# EAGLE design usb_fpga (EAGLE 5.10)
DIGIKEY: CTX283LVCT-ND

## Sheet 1 of 2
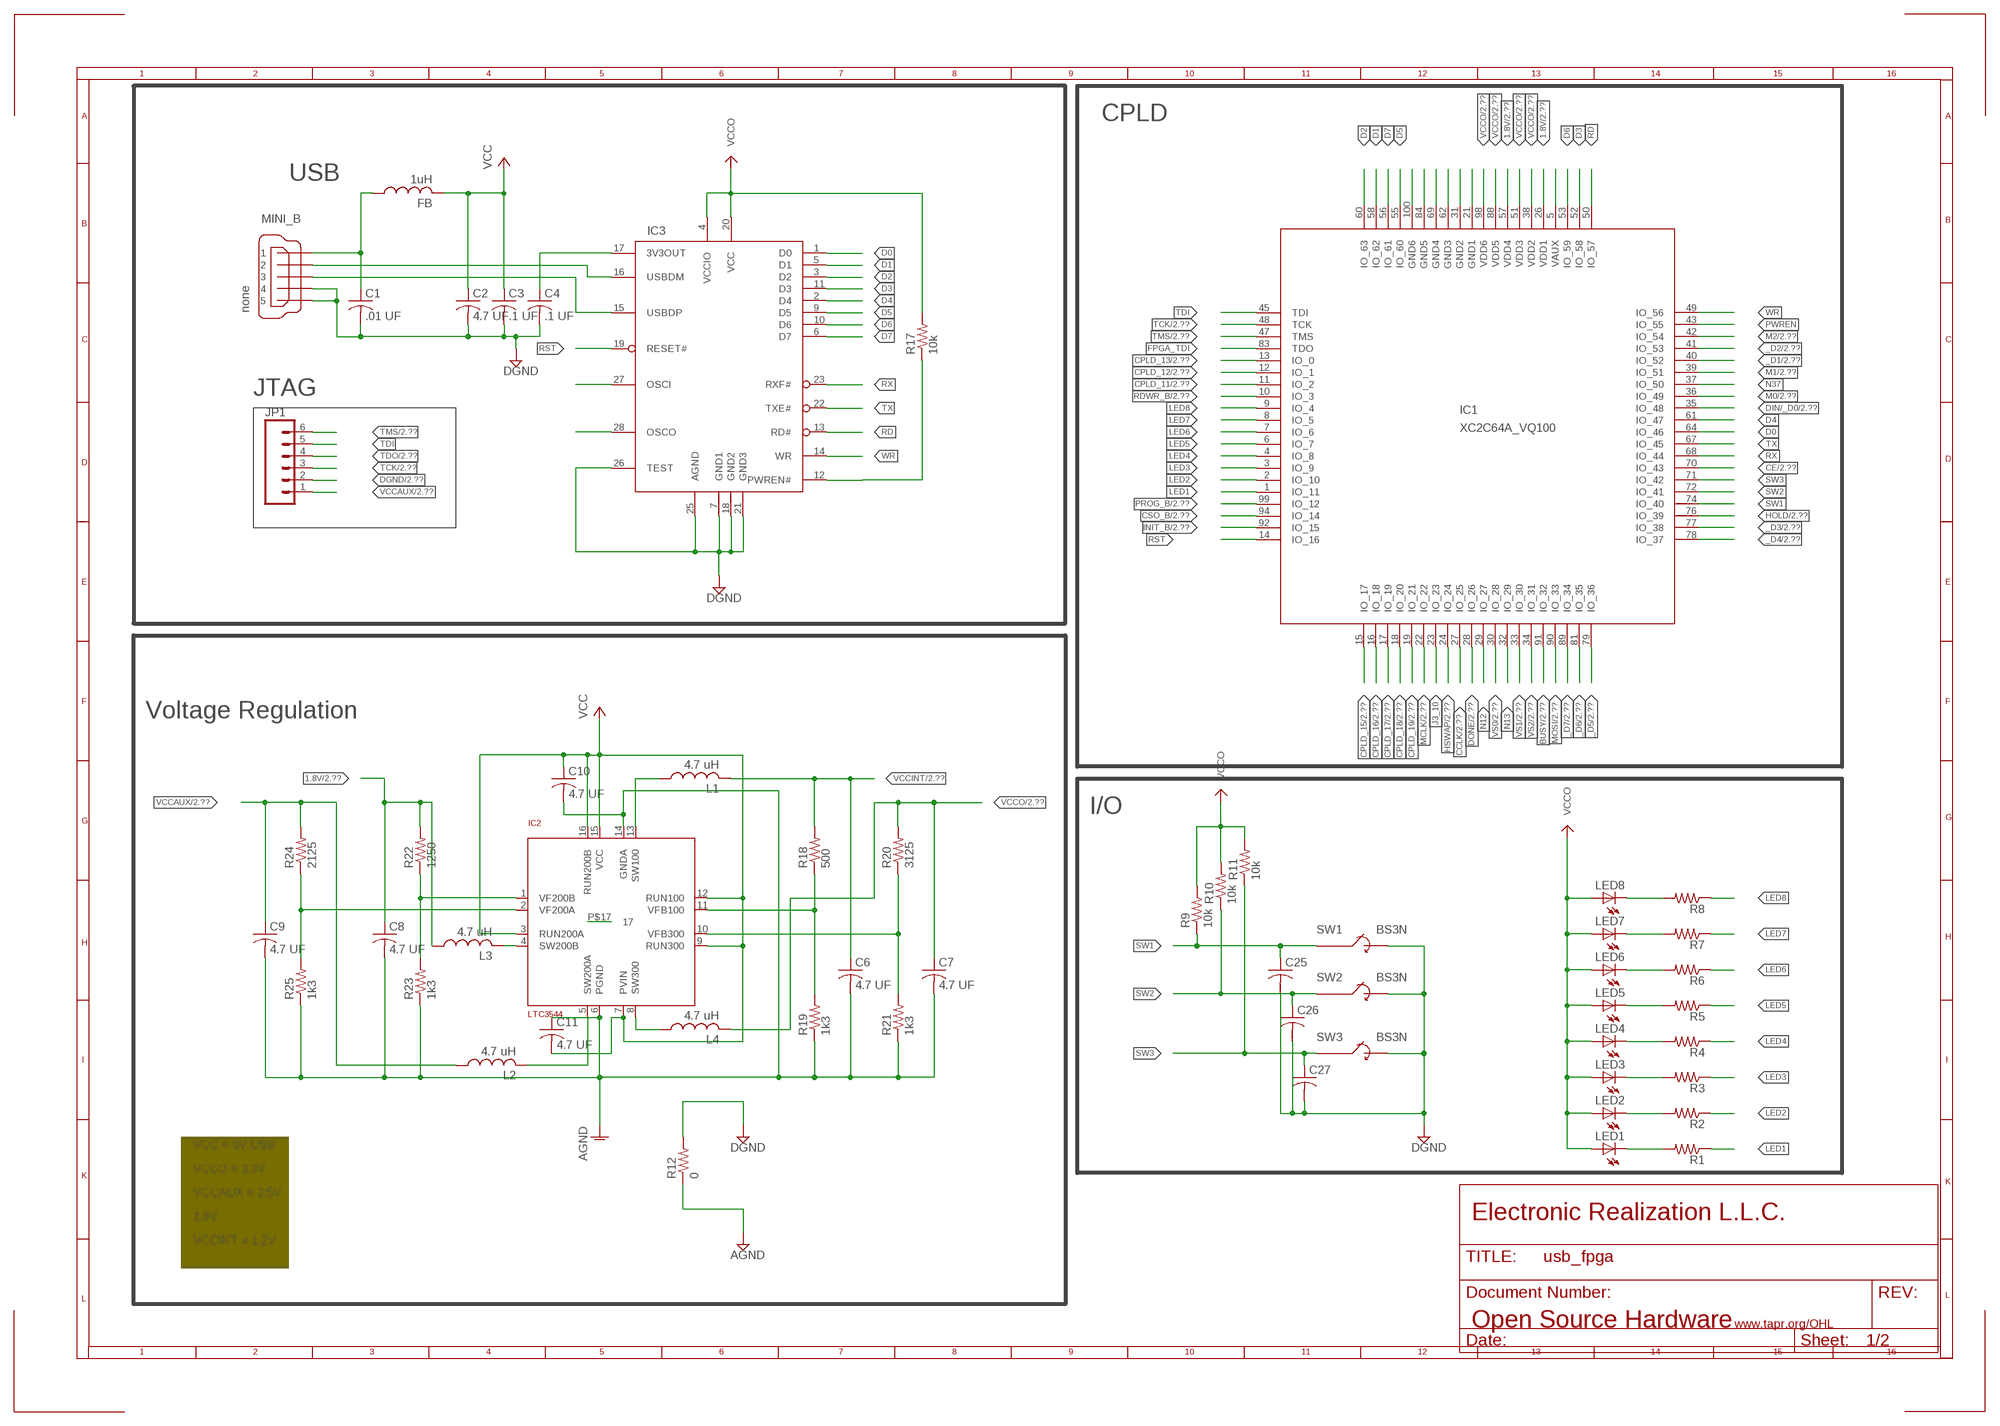
[diagram p0: schematic, sheet 1]

### Parts
C1  .01 UF  C-USC0402  [C0402]
C2  4.7 UF  C-USC0402  [C0402]
C3  .1 UF  C-USC0402  [C0402]
C4  .1 UF  C-USC0402  [C0402]
C6  4.7 UF  C-USC0402  [C0402]
C7  4.7 UF  C-USC0402  [C0402]
C8  4.7 UF  C-USC0402  [C0402]
C9  4.7 UF  C-USC0402  [C0402]
C10  4.7 UF  C-USC0402  [C0402]
C11  4.7 UF  C-USC0402  [C0402]
C25  C-USC0402  [C0402]
C26  C-USC0402  [C0402]
C27  C-USC0402  [C0402]
FB  1uH  FB  [R0805]
IC1  XC2C64A_VQ100  [VQ100]
IC2  LTC3544  [QFN16]
IC3  FT245RL  [SSOP28DB]
JP1  M06POLAR_LOCK  [MOLEX-1X6_LOCK]
L1  4.7 uH  TDK3010  [L3010]
L2  4.7 uH  TDK3010  [L3010]
L3  4.7 uH  TDK3010  [L3010]
L4  4.7 uH  TDK3010  [L3010]
LED1  LEDCHIPLED_0603  [CHIPLED_0603]
LED2  LEDCHIPLED_0603  [CHIPLED_0603]
LED3  LEDCHIPLED_0603  [CHIPLED_0603]
LED4  LEDCHIPLED_0603  [CHIPLED_0603]
LED5  LEDCHIPLED_0603  [CHIPLED_0603]
LED6  LEDCHIPLED_0603  [CHIPLED_0603]
LED7  LEDCHIPLED_0603  [CHIPLED_0603]
LED8  LEDCHIPLED_0603  [CHIPLED_0603]
MINI_B  none  MINI-USB-UX60A-MB-5ST  [UX60A-MB-5ST]
R1  R-US_R0402  [R0402]
R2  R-US_R0402  [R0402]
R3  R-US_R0402  [R0402]
R4  R-US_R0402  [R0402]
R5  R-US_R0402  [R0402]
R6  R-US_R0402  [R0402]
R7  R-US_R0402  [R0402]
R8  R-US_R0402  [R0402]
R9  10k  R-US_R0402  [R0402]
R10  10k  R-US_R0402  [R0402]
R11  10k  R-US_R0402  [R0402]
R12  0  R-US_R0402  [R0402]
R17  10k  R-US_R0402  [R0402]
R18  500  R-US_R0402  [R0402]
R19  1k3  R-US_R0402  [R0402]
R20  3125  R-US_R0402  [R0402]
R21  1k3  R-US_R0402  [R0402]
R22  1250  R-US_R0402  [R0402]
R23  1k3  R-US_R0402  [R0402]
R24  2125  R-US_R0402  [R0402]
R25  1k3  R-US_R0402  [R0402]
SW1  BS3N  [BS3N]
SW2  BS3N  [BS3N]
SW3  BS3N  [BS3N]

### Nets
1.8V: C8.1 IC1.26(VDD1) IC1.57(VDD4) L3.P$1 R22.2 ; also sheet 2
_D1: IC1.40(IO_52) ; also sheet 2
_D2: IC1.41(IO_53) ; also sheet 2
_D3: IC1.77(IO_38) ; also sheet 2
_D4: IC1.78(IO_37) ; also sheet 2
_D5: IC1.79(IO_36) ; also sheet 2
_D6: IC1.81(IO_35) ; also sheet 2
_D7: IC1.89(IO_34) ; also sheet 2
AGND: C6.2 C7.2 C8.2 C9.2 C10.2 C11.1 IC2.6(PGND) IC2.14(GNDA) IC2.P$17 R12.1 R19.1 R21.1 R23.1 R25.1
BUSY: IC1.91(IO_32) ; also sheet 2
CCLK: IC1.27(IO_25) ; also sheet 2
CE: IC1.70(IO_43) ; also sheet 2
CPLD_11: IC1.11(IO_2) ; also sheet 2
CPLD_12: IC1.12(IO_1) ; also sheet 2
CPLD_13: IC1.13(IO_0) ; also sheet 2
CPLD_15: IC1.15(IO_17) ; also sheet 2
CPLD_16: IC1.16(IO_18) ; also sheet 2
CPLD_17: IC1.17(IO_19) ; also sheet 2
CPLD_18: IC1.18(IO_20) ; also sheet 2
CPLD_19: IC1.19(IO_21) ; also sheet 2
CSO_B: IC1.94(IO_14) ; also sheet 2
D0: IC1.64(IO_46) IC3.1(D0)
D1: IC1.58(IO_62) IC3.5(D1)
D2: IC1.60(IO_63) IC3.3(D2)
D3: IC1.52(IO_58) IC3.11(D3)
D4: IC1.61(IO_47) IC3.2(D4)
D5: IC1.55(IO_60) IC3.9(D5)
D6: IC1.53(IO_59) IC3.10(D6)
D7: IC1.56(IO_61) IC3.6(D7)
DGND: C1.2 C2.2 C3.2 C4.2 C25.2 C26.2 C27.2 IC1.21(GND1) IC1.31(GND2) IC1.62(GND3) IC1.69(GND4) IC1.84(GND5) IC1.100(GND6) IC3.7(GND1) IC3.18(GND2) IC3.21(GND3) IC3.25(AGND) IC3.26(TEST) JP1.2 MINI_B.4 MINI_B.5 R12.2 SW1.2 SW2.2 SW3.2 ; also sheet 2
DIN/_D0: IC1.35(IO_48) ; also sheet 2
DONE: IC1.28(IO_26) ; also sheet 2
FPGA_TDI: IC1.83(TDO) ; also sheet 2
HOLD: IC1.76(IO_39) ; also sheet 2
HSWAP: IC1.24(IO_24) ; also sheet 2
INIT_B: IC1.92(IO_15) ; also sheet 2
J3_10: IC1.23(IO_23)
LED1: IC1.1(IO_11) R1.1
LED2: IC1.2(IO_10) R2.1
LED3: IC1.3(IO_9) R3.1
LED4: IC1.4(IO_8) R4.1
LED5: IC1.6(IO_7) R5.1
LED6: IC1.7(IO_6) R6.1
LED7: IC1.8(IO_5) R7.1
LED8: IC1.9(IO_4) R8.1
M0: IC1.36(IO_49) ; also sheet 2
M1: IC1.39(IO_51) ; also sheet 2
M2: IC1.42(IO_54) ; also sheet 2
MCLK: IC1.22(IO_22) ; also sheet 2
MOSI: IC1.90(IO_33) ; also sheet 2
N12: IC1.29(IO_27)
N13: IC1.32(IO_29)
N37: IC1.37(IO_50)
N$2: IC2.1(VF200B) R22.1 R23.2
N$3: IC2.2(VF200A) R24.1 R25.2
N$4: IC2.11(VFB100) R18.1 R19.2
N$5: C1.1 FB.1 MINI_B.1
N$6: IC2.10(VFB300) R20.1 R21.2
N$7: IC2.13(SW100) L1.P$1
N$13: IC2.8(SW300) L4.P$1
N$16: IC2.5(SW200A) L2.P$2
N$17: IC2.4(SW200B) L3.P$2
N$183: C4.1 IC3.17(3V3OUT)
N$187: IC3.27(OSCI)
N$188: IC3.28(OSCO)
N$196: LED1.C R1.2
N$197: LED2.C R2.2
N$198: LED3.C R3.2
N$199: LED4.C R4.2
N$200: LED5.C R5.2
N$201: LED6.C R6.2
N$202: LED7.C R7.2
N$203: LED8.C R8.2
PROG_B: IC1.99(IO_12) ; also sheet 2
PWREN: IC1.43(IO_55) IC3.12(PWREN#) R17.1
RD: IC1.50(IO_57) IC3.13(RD#)
RDWR_B: IC1.10(IO_3) ; also sheet 2
RST: IC1.14(IO_16) IC3.19(RESET#)
RX: IC1.68(IO_44) IC3.23(RXF#)
SW1: C25.1 IC1.74(IO_40) R9.1 SW1.1
SW2: C26.1 IC1.72(IO_41) R10.1 SW2.1
SW3: C27.1 IC1.71(IO_42) R11.1 SW3.1
TCK: IC1.48(TCK) JP1.3 ; also sheet 2
TDI: IC1.45(TDI) JP1.5
TDO: JP1.4 ; also sheet 2
TMS: IC1.47(TMS) JP1.6 ; also sheet 2
TX: IC1.67(IO_45) IC3.22(TXE#)
USBDM: IC3.16(USBDM) MINI_B.2
USBDP: IC3.15(USBDP) MINI_B.3
VCC: C2.1 C3.1 C10.1 C11.2 FB.2 IC2.3(RUN200A) IC2.7(PVIN) IC2.9(RUN300) IC2.12(RUN100) IC2.15(VCC) IC2.16(RUN200B)
VCCAUX: C9.1 IC1.5(VAUX) JP1.1 L2.P$1 R24.2 ; also sheet 2
VCCINT: C6.1 L1.P$2 R18.2 ; also sheet 2
VCCO: C7.1 IC1.38(VDD2) IC1.51(VDD3) IC1.88(VDD5) IC1.98(VDD6) IC3.4(VCCIO) IC3.20(VCC) L4.P$2 LED1.A LED2.A LED3.A LED4.A LED5.A LED6.A LED7.A LED8.A R9.2 R10.2 R11.2 R17.2 R20.2 ; also sheet 2
VS0: IC1.30(IO_28) ; also sheet 2
VS1: IC1.33(IO_30) ; also sheet 2
VS2: IC1.34(IO_31) ; also sheet 2
WR: IC1.49(IO_56) IC3.14(WR)

### Notes on the sheet
- CPLD
- USB
- JTAG
- Voltage Regulation
- I/O
- VCC = 5V USB
- VCCO = 3.3V
- VCCAUX = 2.5V
- 1.8V | Electronic Realization L.L.C.
- VCCINT = 1.2V
- Open Source Hardware | www.tapr.org/OHL

## Sheet 2 of 2
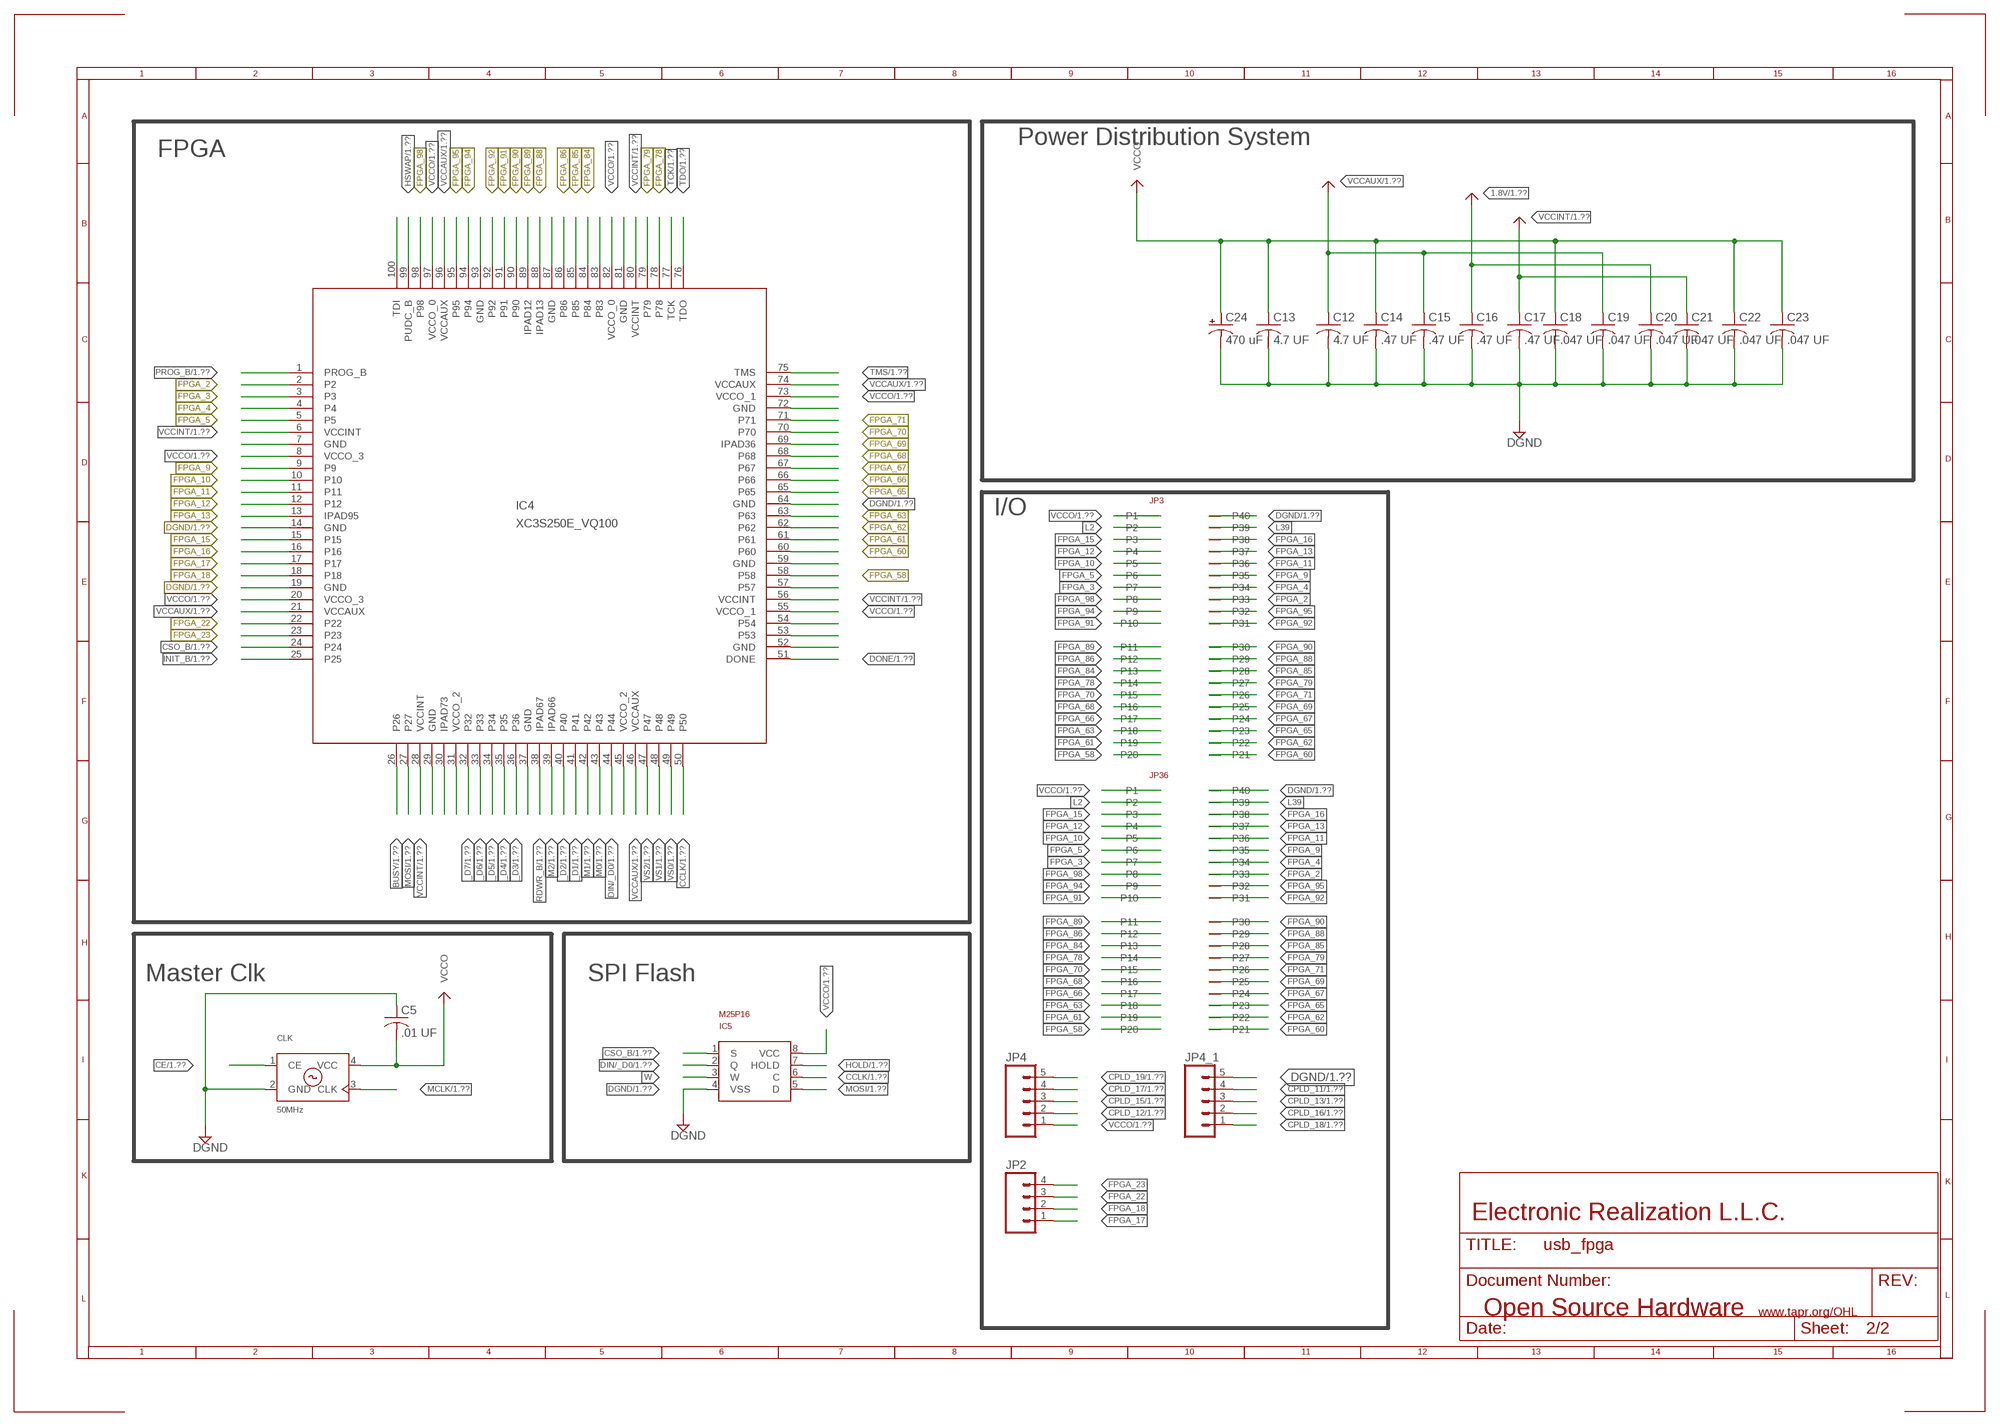
[diagram p1: schematic, sheet 2]

### Parts
C5  .01 UF  C-USC0402  [C0402]
C12  4.7 UF  C-USC0402  [C0402]
C13  4.7 UF  C-USC0402  [C0402]
C14  .47 UF  C-USC0402  [C0402]
C15  .47 UF  C-USC0402  [C0402]
C16  .47 UF  C-USC0402  [C0402]
C17  .47 UF  C-USC0402  [C0402]
C18  .047 UF  C-USC0402  [C0402]
C19  .047 UF  C-USC0402  [C0402]
C20  .047 UF  C-USC0402  [C0402]
C21  .047 UF  C-USC0402  [C0402]
C22  .047 UF  C-USC0402  [C0402]
C23  .047 UF  C-USC0402  [C0402]
C24  470 uF  CPOL-USD/7343-31R  [D/7343-31R]
CLK  50MHz  CB3  [CB3]
IC4  XC3S250E_VQ100  XC3S100E_VQ100  [VQ100]
IC5  M25P16  [VDFPN8]
JP2  M04LOCK  [1X04_LOCK]
JP3  LOCK_40  [LOCK_40]
JP4  M05LOCK  [1X05_LOCK]
JP4_1  M05LOCK  [1X05_LOCK]
JP36  BRD_EDGE_40  [STRADDLE_40]

### Nets
1.8V: C16.1 C20.1 ; also sheet 1
_D1: IC4.41 ; also sheet 1
_D2: IC4.40 ; also sheet 1
_D3: IC4.36 ; also sheet 1
_D4: IC4.35 ; also sheet 1
_D5: IC4.34 ; also sheet 1
_D6: IC4.33 ; also sheet 1
_D7: IC4.32 ; also sheet 1
BUSY: IC4.26 ; also sheet 1
CCLK: IC4.50 IC5.6(C) ; also sheet 1
CE: CLK.1(CE) ; also sheet 1
CPLD_11: JP4_1.4 ; also sheet 1
CPLD_12: JP4.2 ; also sheet 1
CPLD_13: JP4_1.3 ; also sheet 1
CPLD_15: JP4.3 ; also sheet 1
CPLD_16: JP4_1.2 ; also sheet 1
CPLD_17: JP4.4 ; also sheet 1
CPLD_18: JP4_1.1 ; also sheet 1
CPLD_19: JP4.5 ; also sheet 1
CSO_B: IC4.24 IC5.1(S) ; also sheet 1
DGND: C5.1 C12.2 C13.2 C14.2 C15.2 C16.2 C17.2 C18.2 C19.2 C20.2 C21.2 C22.2 C23.2 C24.- CLK.2(GND) IC4.7(GND) IC4.14(GND) IC4.19(GND) IC4.29(GND) IC4.37(GND) IC4.52(GND) IC4.59(GND) IC4.64(GND) IC4.72(GND) IC4.81(GND) IC4.87(GND) IC4.93(GND) IC5.4(VSS) JP3.40 JP4_1.5 JP36.P$40(P40) ; also sheet 1
DIN/_D0: IC4.44 IC5.2(Q) ; also sheet 1
DONE: IC4.51(DONE) ; also sheet 1
FPGA_2: IC4.2 JP3.33 JP36.P$33(P33)
FPGA_3: IC4.3 JP3.7 JP36.P$7(P7)
FPGA_4: IC4.4 JP3.34 JP36.P$34(P34)
FPGA_5: IC4.5 JP3.6 JP36.P$6(P6)
FPGA_9: IC4.9 JP3.35 JP36.P$35(P35)
FPGA_10: IC4.10 JP3.5 JP36.P$5(P5)
FPGA_11: IC4.11 JP3.36 JP36.P$36(P36)
FPGA_12: IC4.12 JP3.4 JP36.P$4(P4)
FPGA_13: IC4.13(IPAD95) JP3.37 JP36.P$37(P37)
FPGA_15: IC4.15 JP3.3 JP36.P$3(P3)
FPGA_16: IC4.16 JP3.38 JP36.P$38(P38)
FPGA_17: IC4.17 JP2.1
FPGA_18: IC4.18 JP2.2
FPGA_22: IC4.22 JP2.3
FPGA_23: IC4.23 JP2.4
FPGA_58: IC4.58 JP3.20 JP36.P$20(P20)
FPGA_60: IC4.60 JP3.21 JP36.P$21(P21)
FPGA_61: IC4.61 JP3.19 JP36.P$19(P19)
FPGA_62: IC4.62 JP3.22 JP36.P$22(P22)
FPGA_63: IC4.63 JP3.18 JP36.P$18(P18)
FPGA_65: IC4.65 JP3.23 JP36.P$23(P23)
FPGA_66: IC4.66 JP3.17 JP36.P$17(P17)
FPGA_67: IC4.67 JP3.24 JP36.P$24(P24)
FPGA_68: IC4.68 JP3.16 JP36.P$16(P16)
FPGA_69: IC4.69(IPAD36) JP3.25 JP36.P$25(P25)
FPGA_70: IC4.70 JP3.15 JP36.P$15(P15)
FPGA_71: IC4.71 JP3.26 JP36.P$26(P26)
FPGA_78: IC4.78 JP3.14 JP36.P$14(P14)
FPGA_79: IC4.79 JP3.27 JP36.P$27(P27)
FPGA_84: IC4.84 JP3.13 JP36.P$13(P13)
FPGA_85: IC4.85 JP3.28 JP36.P$28(P28)
FPGA_86: IC4.86 JP3.12 JP36.P$12(P12)
FPGA_88: IC4.88(IPAD13) JP3.29 JP36.P$29(P29)
FPGA_89: IC4.89(IPAD12) JP3.11 JP36.P$11(P11)
FPGA_90: IC4.90 JP3.30 JP36.P$30(P30)
FPGA_91: IC4.91 JP3.10 JP36.P$10(P10)
FPGA_92: IC4.92 JP3.31 JP36.P$31(P31)
FPGA_94: IC4.94 JP3.9 JP36.P$9(P9)
FPGA_95: IC4.95 JP3.32 JP36.P$32(P32)
FPGA_98: IC4.98 JP3.8 JP36.P$8(P8)
FPGA_TDI: IC4.100(TDI) ; also sheet 1
HOLD: IC5.7(HOLD) ; also sheet 1
HSWAP: IC4.99(PUDC_B) ; also sheet 1
INIT_B: IC4.25 ; also sheet 1
L2: JP3.2 JP36.P$2(P2)
L39: JP3.39 JP36.P$39(P39)
M0: IC4.43 ; also sheet 1
M1: IC4.42 ; also sheet 1
M2: IC4.39(IPAD66) ; also sheet 1
MCLK: CLK.3(CLK) IC4.83 ; also sheet 1
MOSI: IC4.27 IC5.5(D) ; also sheet 1
N$224: IC4.30(IPAD73)
N$284: IC4.53
N$285: IC4.54
N$288: IC4.57
PROG_B: IC4.1(PROG_B) ; also sheet 1
RDWR_B: IC4.38(IPAD67) ; also sheet 1
TCK: IC4.77(TCK) ; also sheet 1
TDO: IC4.76(TDO) ; also sheet 1
TMS: IC4.75(TMS) ; also sheet 1
VCCAUX: C12.1 C15.1 C19.1 IC4.21(VCCAUX) IC4.46(VCCAUX) IC4.74(VCCAUX) IC4.96(VCCAUX) ; also sheet 1
VCCINT: C17.1 C21.1 IC4.6(VCCINT) IC4.28(VCCINT) IC4.56(VCCINT) IC4.80(VCCINT) ; also sheet 1
VCCO: C5.2 C13.1 C14.1 C18.1 C22.1 C23.1 C24.+ CLK.4(VCC) IC4.8(VCCO_3) IC4.20(VCCO_3) IC4.31(VCCO_2) IC4.45(VCCO_2) IC4.55(VCCO_1) IC4.73(VCCO_1) IC4.82(VCCO_0) IC4.97(VCCO_0) IC5.8(VCC) JP3.1 JP4.1 JP36.P$1(P1) ; also sheet 1
VS0: IC4.49 ; also sheet 1
VS1: IC4.48 ; also sheet 1
VS2: IC4.47 ; also sheet 1
W: IC5.3(W)

### Notes on the sheet
- Power Distribution System
- FPGA
- I/O
- Master Clk | SPI Flash
- Electronic Realization L.L.C.
- Open Source Hardware | www.tapr.org/OHL

## Library data of the parts
C1-C23 C25-C27 = rcl:C-US: CAPACITOR, American symbol
C24 = rcl:CPOL-US: POLARIZED CAPACITOR, American symbol
CLK = crystal:CB3
FB = rcl:FB
IC1 = xilinx:XC2C64A_VQ100: xc2c64a_vq100 edit this description Auto generated by make-symbol-device-package-bsdl.ulp Rev. 29 Source: xc2c64a_vq100.bsd
IC2 = linear-technology:LTC3544
IC3 = ftdichip-3:FT245RL: USB FIFO Controller 4th Generation USB Controller (USB <-> Parallel) - FIFO
IC4 = xilinx:XC3S100E_VQ100: xc3s100e_vq100 edit this description Auto generated by make-symbol-device-package-bsdl.ulp Rev. 19 Source: xc3s100e_vq100.bsd
IC5 = st-microelectronics:M25P16
JP1 = SparkFun:M06: Header 6 Standard 6-pin 0.1" header. Use with straight break away headers (SKU : PRT-00116), right angle break away headers (PRT-00553), swiss pins (PRT-00743), machine pins (PRT-00117), and female headers (PRT-00115). Molex polarized connector foot print use with SKU : PRT-08094 with associated crimp pins and housings. NOTES ON THE VARIANTS LOCK and LOCK_LONGPADS... This footprint was designed to help hold the alignment of a through-hole component (i.e. 6-pin header) while soldering it into place. You may notice that each hole has been shifted either up or down by 0.005 of an inch from it's more standard position (which is a perfectly straight line). This slight alteration caused the pins (the squares in the middle) to touch the edges of the holes. Because they are alternating, it causes a "brace" to hold the component in place. 0.005 has proven to be the perfect amount of "off-center" position when using our standard breakaway headers. Although looks a little odd when you look at the bare footprint, once you have a header in there, the alteration is very hard to notice. Also, if you push a header all the way into place, it is covered up entirely on the bottom side. This idea of altering the position of holes to aid alignment will be further integrated into the Sparkfun Library for other footprints. It can help hold any component with 3 or more connection pins.
JP2 = SparkFun:M04: Header 4 Standard 4-pin 0.1" header. Use with straight break away headers (SKU : PRT-00116), right angle break away headers (PRT-00553), swiss pins (PRT-00743), machine pins (PRT-00117), and female headers (PRT-00115). Molex polarized connector foot print use with SKU : PRT-08231 with associated crimp pins and housings.
JP3 = brd_egde:LOCK_40
JP4 JP4_1 = SparkFun:M05: Header 5 Standard 5-pin 0.1" header. Use with straight break away headers (SKU : PRT-00116), right angle break away headers (PRT-00553), swiss pins (PRT-00743), machine pins (PRT-00117), and female headers (PRT-00115). Molex polarized connector foot print use with SKU : PRT-08230 with associated crimp pins and housings.
JP36 = brd_egde:BRD_EDGE_40
L1-L4 = rcl:TDK3010
LED1-LED8 = led:LED: LED OSRAM: - CHIPLED LG R971, LG N971, LY N971, LG Q971, LY Q971, LO R971, LY R971 LH N974, LH R974 LS Q976, LO Q976, LY Q976 LO Q996 - Hyper CHIPLED LW Q18S LB Q993, LB Q99A, LB R99A - SideLED LS A670, LO A670, LY A670, LG A670, LP A670 LB A673, LV A673, LT A673, LW A673 LH A674 LY A675 LS A676, LA A676, LO A676, LY A676, LW A676 LS A679, LY A679, LG A679 - Hyper Micro SIDELED® LS Y876, LA Y876, LO Y876, LY Y876 LT Y87S - SmartLED LW L88C, LW L88S LB L89C, LB L89S, LG L890 LS L89K, LO L89K, LY L89K LS L896, LA L896, LO L896, LY L896 - TOPLED LS T670, LO T670, LY T670, LG T670, LP T670 LSG T670, LSP T670, LSY T670, LOP T670, LYG T670 LG T671, LOG T671, LSG T671 LB T673, LV T673, LT T673, LW T673 LH T674 LS T676, LA T676, LO T676, LY T676, LB T676, LH T676, LSB T676, LW T676 LB T67C, LV T67C, LT T67C, LS T67K, LO T67K, LY T67K, LW E67C LS E67B, LA E67B, LO E67B, LY E67B, LB E67C, LV E67C, LT E67C LW T67C LS T679, LY T679, LG T679 LS T770, LO T770, LY T770, LG T770, LP T770 LB T773, LV T773, LT T773, LW T773 LH T774 LS E675, LA E675, LY E675, LS T675 LS T776, LA T776, LO T776, LY T776, LB T776 LHGB T686 LT T68C, LB T68C - Hyper Mini TOPLED® LB M676 - Mini TOPLED Santana® LG M470 LS M47K, LO M47K, LY M47K Source: http://www.osram.convergy.de LUXEON: - LUMILED® LXK2-PW12-R00, LXK2-PW12-S00, LXK2-PW14-U00, LXK2-PW14-V00 LXK2-PM12-R00, LXK2-PM12-S00, LXK2-PM14-U00 LXK2-PE12-Q00, LXK2-PE12-R00, LXK2-PE12-S00, LXK2-PE14-T00, LXK2-PE14-U00 LXK2-PB12-K00, LXK2-PB12-L00, LXK2-PB12-M00, LXK2-PB14-N00, LXK2-PB14-P00, LXK2-PB14-Q00 LXK2-PR12-L00, LXK2-PR12-M00, LXK2-PR14-Q00, LXK2-PR14-R00 LXK2-PD12-Q00, LXK2-PD12-R00, LXK2-PD12-S00 LXK2-PH12-R00, LXK2-PH12-S00 LXK2-PL12-P00, LXK2-PL12-Q00, LXK2-PL12-R00 Source: www.luxeon.com KINGBRIGHT: KA-3528ASYC Source: www.kingbright.com
MINI_B = con-hirose:MINI-USB-: MINI USB Connector Source: http://www.hirose.co.jp/cataloge_hp/e24000019.pdf
R1-R12 R17-R25 = rcl:R-US_: RESISTOR, American symbol
SW1-SW3 = switch-omron:BS3N

## Board
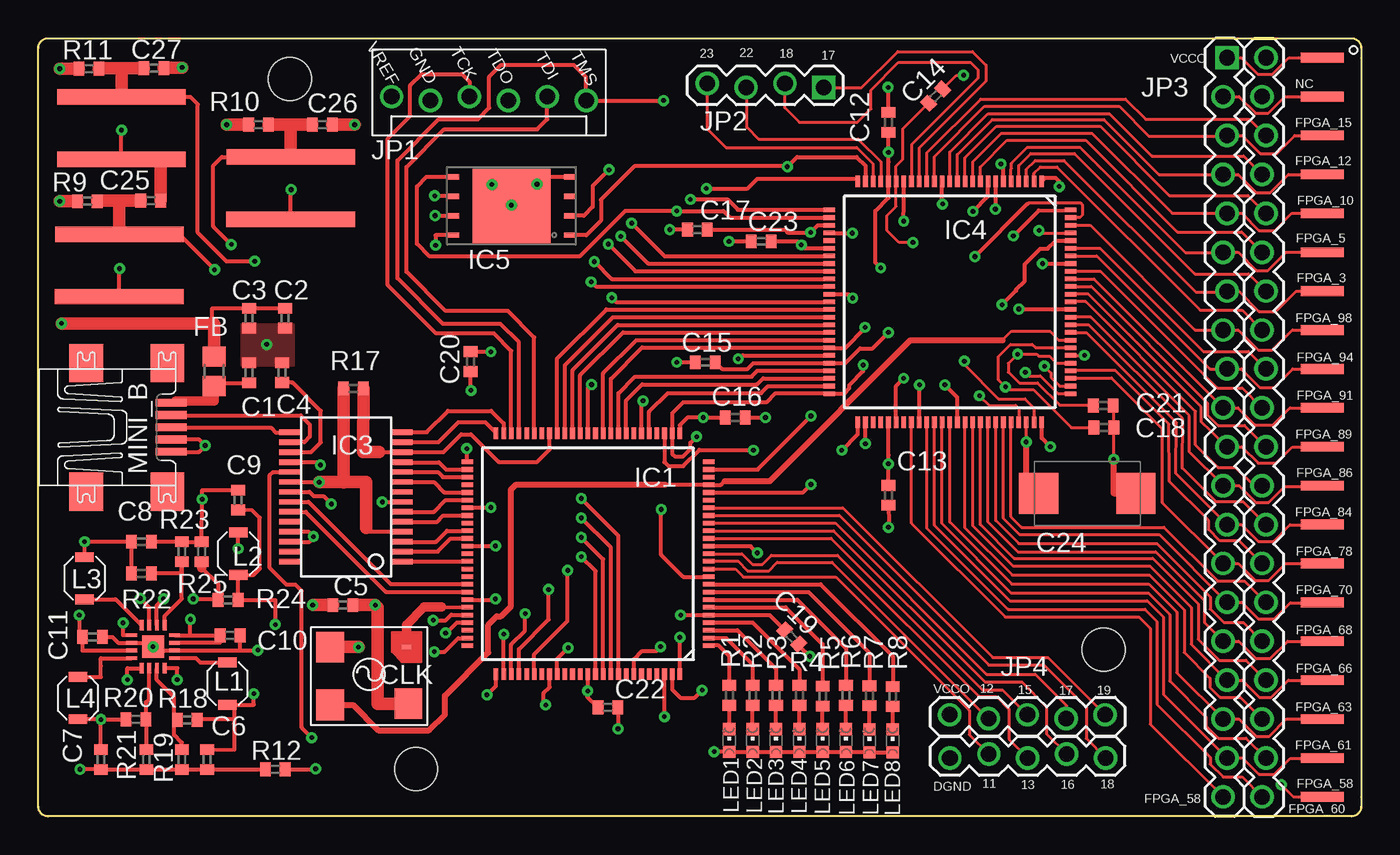
[diagram p2: board, top side]
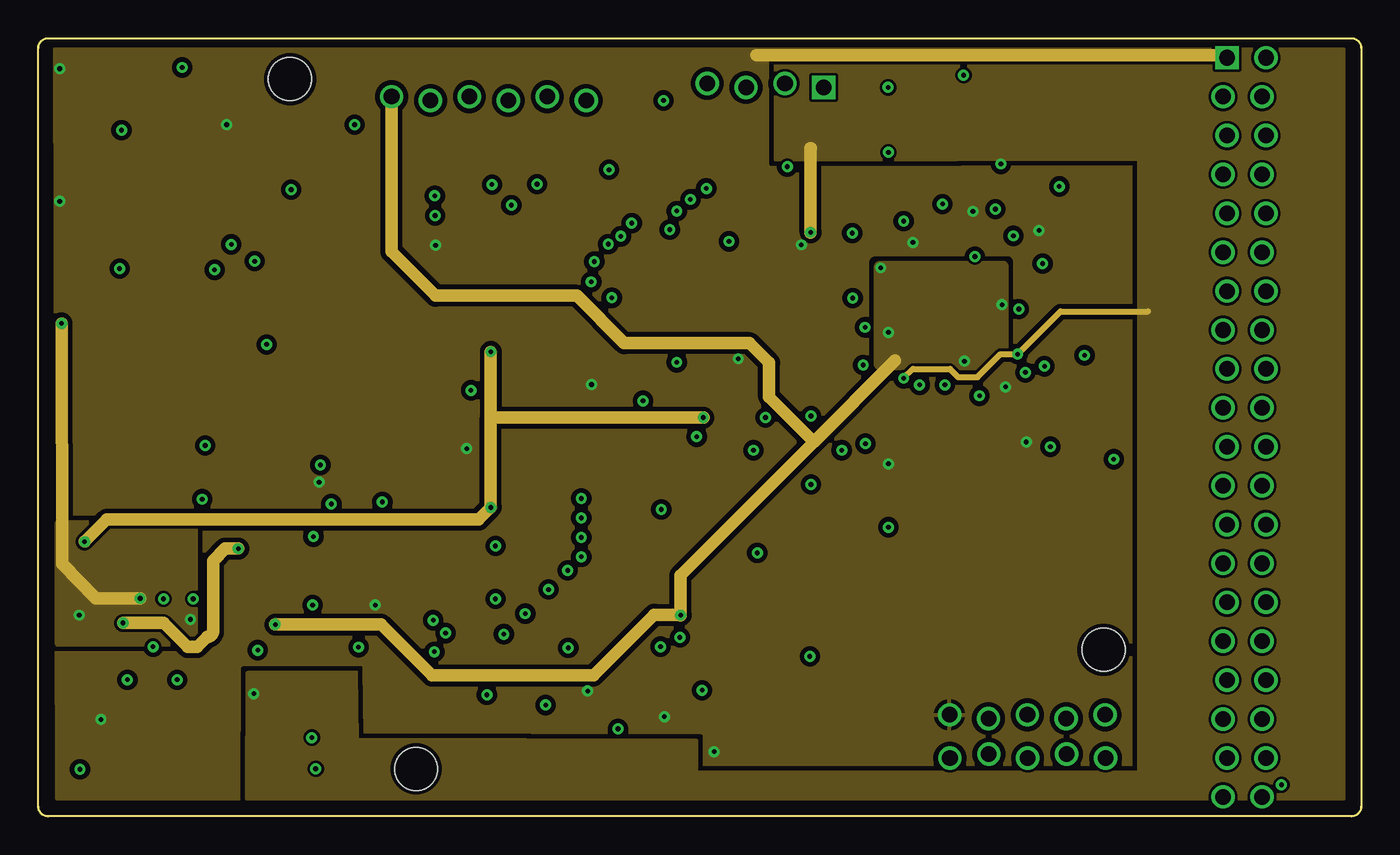
[diagram p3: board, inner layer Route2]
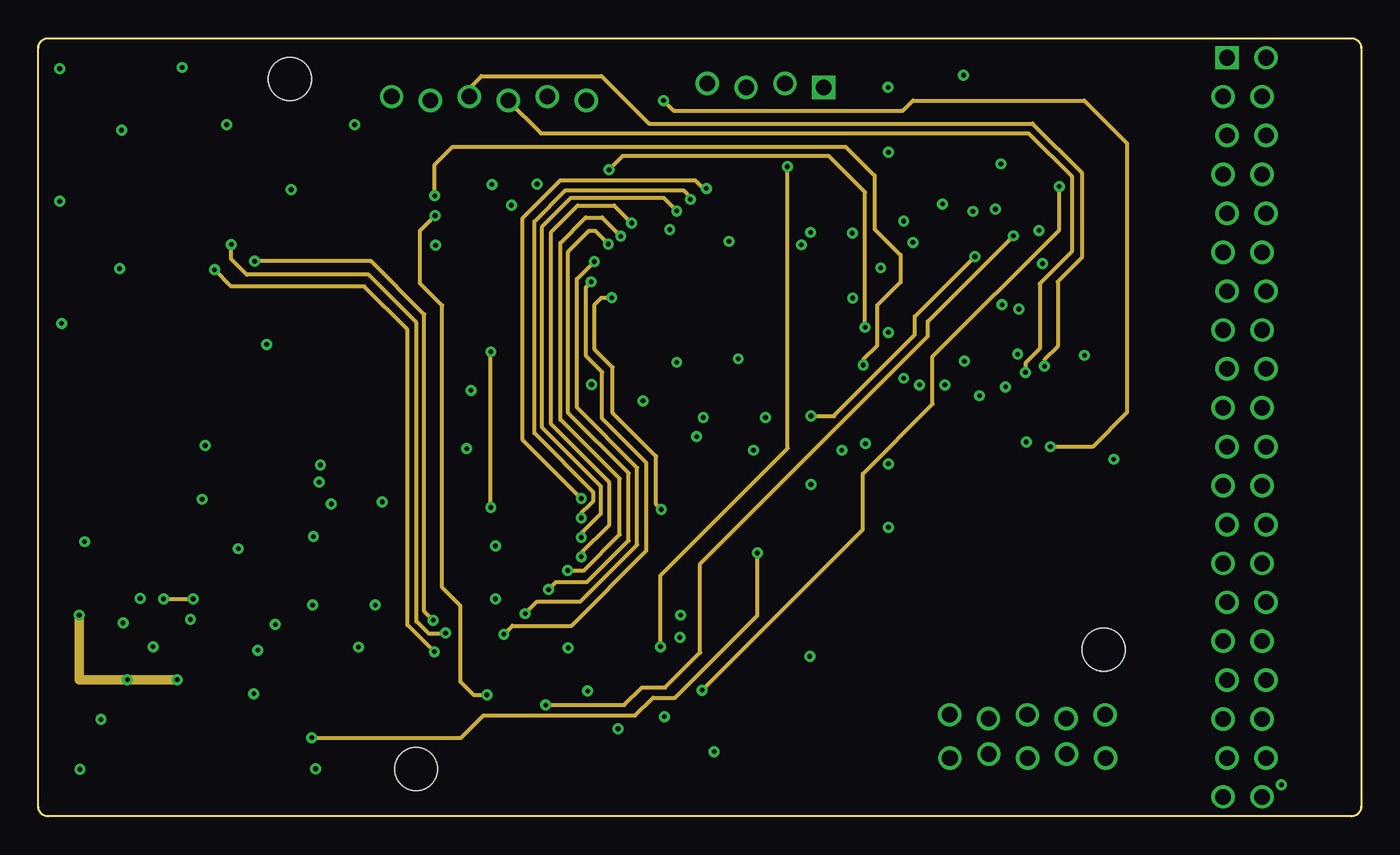
[diagram p4: board, inner layer Route15]
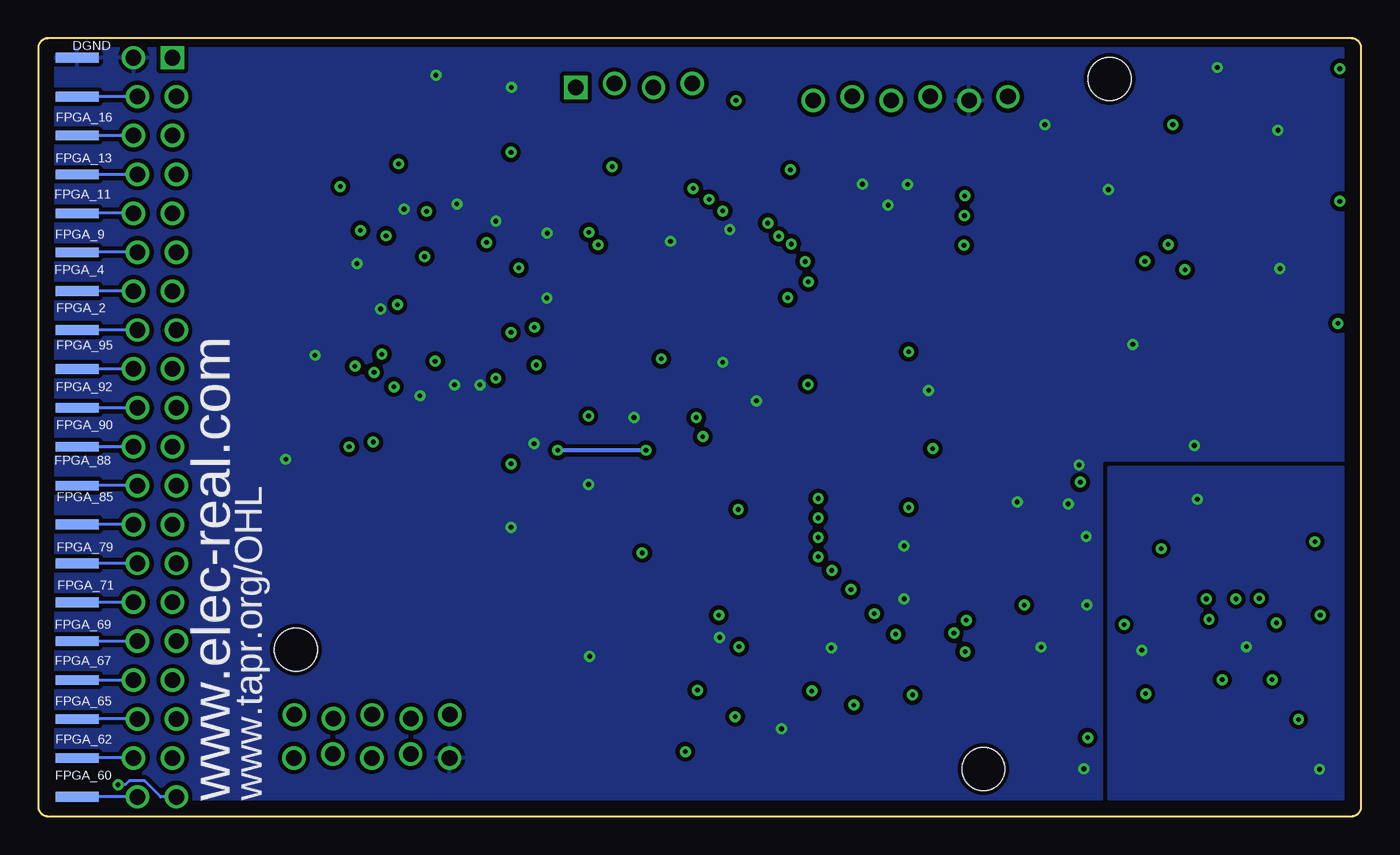
[diagram p5: board, bottom side, seen from below]

Size 86.36 x 50.8 mm. Coordinates in mm from the lower left corner, seen from the top.
Outline: 0,0.64 0,50.16 arc-90 0.64,50.8 85.72,50.8 arc-90 86.36,50.16 86.36,0.64 arc-90 85.72,0 0.64,0 arc-90 0,0.64
Copper layers (1*2+15*16): Top 0.055mm / dielectric 0.15mm / Route2 0.055mm / dielectric 0.15mm / Route15 0.055mm / dielectric 0.15mm / Bottom 0.055mm
Design rules "default *": minimum track width 5mil, minimum drill 12mil, track to track 7mil, track to pad 7mil, pad to pad 7mil, via to via 7mil, smd to smd 6mil, copper to edge 10mil, drill to drill 12mil, minimum pad ring 10mil, minimum via ring 8mil, stop-mask expansion 4mil, vias tented up to drill 0mil, thermal gap 10mil
Holes 2.8 mm at 69.55,10.87 16.43,48.13 24.66,3.1

### Footprints (pad centres in the part's own frame; a part is rotated, then mirrored left to right if it is on the bottom)
C0402 = smd 0.7 x 0.9: 1 -0.65,0; 2 0.65,0
D/7343-31R = smd 2.55 x 2.7: + 3.175,0; - -3.175,0
CB3 = smd 0.61 x 0.305: 1 -2.445,-1.905 | smd 1.803 x 2.007: 2 2.54,-1.905; 3 2.54,1.873; 4 -2.561,1.789
R0805 = smd 1.3 x 1.5: 1 -0.95,0; 2 0.95,0
VQ100 = smd 0.75 x 0.3: 1 -7.875,6; 2 -7.875,5.5; 3 -7.875,5; 4 -7.875,4.5; 5 -7.875,4; 6 -7.875,3.5; 7 -7.875,3; 8 -7.875,2.5; 9 -7.875,2; 10 -7.875,1.5; 11 -7.875,1; 12 -7.875,0.5; 13 -7.875,0; 14 -7.875,-0.5; 15 -7.875,-1; 16 -7.875,-1.5; 17 -7.875,-2; 18 -7.875,-2.5; 19 -7.875,-3; 20 -7.875,-3.5; 21 -7.875,-4; 22 -7.875,-4.5; 23 -7.875,-5; 24 -7.875,-5.5; 25 -7.875,-6; 51 7.875,-6; 52 7.875,-5.5; 53 7.875,-5; 54 7.875,-4.5; 55 7.875,-4; 56 7.875,-3.5; 57 7.875,-3; 58 7.875,-2.5; 59 7.875,-2; 60 7.875,-1.5; 61 7.875,-1; 62 7.875,-0.5; 63 7.875,0; 64 7.875,0.5; 65 7.875,1; 66 7.875,1.5; 67 7.875,2; 68 7.875,2.5; 69 7.875,3; 70 7.875,3.5; 71 7.875,4; 72 7.875,4.5; 73 7.875,5; 74 7.875,5.5; 75 7.875,6 | smd 0.3 x 0.75: 26 -6,-7.875; 27 -5.5,-7.875; 28 -5,-7.875; 29 -4.5,-7.875; 30 -4,-7.875; 31 -3.5,-7.875; 32 -3,-7.875; 33 -2.5,-7.875; 34 -2,-7.875; 35 -1.5,-7.875; 36 -1,-7.875; 37 -0.5,-7.875; 38 0,-7.875; 39 0.5,-7.875; 40 1,-7.875; 41 1.5,-7.875; 42 2,-7.875; 43 2.5,-7.875; 44 3,-7.875; 45 3.5,-7.875; 46 4,-7.875; 47 4.5,-7.875; 48 5,-7.875; 49 5.5,-7.875; 50 6,-7.875; 76 6,7.875; 77 5.5,7.875; 78 5,7.875; 79 4.5,7.875; 80 4,7.875; 81 3.5,7.875; 82 3,7.875; 83 2.5,7.875; 84 2,7.875; 85 1.5,7.875; 86 1,7.875; 87 0.5,7.875; 88 0,7.875; 89 -0.5,7.875; 90 -1,7.875; 91 -1.5,7.875; 92 -2,7.875; 93 -2.5,7.875; 94 -3,7.875; 95 -3.5,7.875; 96 -4,7.875; 97 -4.5,7.875; 98 -5,7.875; 99 -5.5,7.875; 100 -6,7.875
QFN16 = smd 0.7 x 0.25: 1 -1.4,0.75; 2 -1.4,0.25; 3 -1.4,-0.25; 4 -1.4,-0.75; 9 1.4,-0.75; 10 1.4,-0.25; 11 1.4,0.25; 12 1.4,0.75 | smd 0.25 x 0.7: 5 -0.75,-1.4; 6 -0.25,-1.4; 7 0.25,-1.4; 8 0.75,-1.4; 13 0.75,1.4; 14 0.25,1.4; 15 -0.25,1.4; 16 -0.75,1.4 | smd 1.45 x 1.45: P$17 0,0
SSOP28DB = smd 0.348 x 1.397: 1 -4.225,-3.656; 2 -3.575,-3.656; 3 -2.925,-3.656; 4 -2.275,-3.656; 5 -1.625,-3.656; 6 -0.975,-3.656; 7 -0.325,-3.656; 8 0.325,-3.656; 9 0.975,-3.656; 10 1.625,-3.656; 11 2.275,-3.656; 12 2.925,-3.656; 13 3.575,-3.656; 14 4.225,-3.656; 15 4.225,3.656; 16 3.575,3.656; 17 2.925,3.656; 18 2.275,3.656; 19 1.625,3.656; 20 0.975,3.656; 21 0.325,3.656; 22 -0.325,3.656; 23 -0.975,3.656; 24 -1.625,3.656; 25 -2.275,3.656; 26 -2.925,3.656; 27 -3.575,3.656; 28 -4.225,3.656
VDFPN8 = smd 0.762 x 0.356: 1 -3.81,1.905; 2 -3.81,0.635; 3 -3.81,-0.635; 4 -3.81,-1.905; 5 3.81,-1.905; 6 3.81,-0.635; 7 3.81,0.635; 8 3.81,1.905 | smd 5.08 x 4.826: NC 0,0
MOLEX-1X6_LOCK = drill 1.016: 1 0,0; 2 2.54,-0.254; 3 5.08,0; 4 7.62,-0.254; 5 10.16,0; 6 12.7,-0.254
1X04_LOCK = drill 1.016 square: 1 0,0.127 | drill 1.016: 2 2.54,-0.127; 3 5.08,0.127; 4 7.62,-0.127
LOCK_40 = drill 1.016 square: 1 -24.13,-1.143 | drill 1.016: 2 -21.59,-1.397; 3 -19.05,-1.143; 4 -16.51,-1.397; 5 -13.97,-1.143; 6 -11.43,-1.397; 7 -8.89,-1.143; 8 -6.35,-1.397; 9 -3.81,-1.143; 10 -1.27,-1.397; 11 1.27,-1.143; 12 3.81,-1.397; 13 6.35,-1.143; 14 8.89,-1.397; 15 11.43,-1.143; 16 13.97,-1.397; 17 16.51,-1.143; 18 19.05,-1.397; 19 21.59,-1.143; 20 24.13,-1.397; 21 24.13,1.143; 22 21.59,1.397; 23 19.05,1.143; 24 16.51,1.397; 25 13.97,1.143; 26 11.43,1.397; 27 8.89,1.143; 28 6.35,1.397; 29 3.81,1.143; 30 1.27,1.397; 31 -1.27,1.143; 32 -3.81,1.397; 33 -6.35,1.143; 34 -8.89,1.397; 35 -11.43,1.143; 36 -13.97,1.397; 37 -16.51,1.143; 38 -19.05,1.397; 39 -21.59,1.143; 40 -24.13,1.397
1X05_LOCK = drill 1.016: 1 0,0.127; 2 2.54,-0.127; 3 5.08,0.127; 4 7.62,-0.127; 5 10.16,0.127
STRADDLE_40 = smd 0.635 x 2.794: P$1 -24.13,-1.27; P$2 -21.59,-1.27; P$3 -19.05,-1.27; P$4 -16.51,-1.27; P$5 -13.97,-1.27; P$6 -11.43,-1.27; P$7 -8.89,-1.27; P$8 -6.35,-1.27; P$9 -3.81,-1.27; P$10 -1.27,-1.27; P$11 1.27,-1.27; P$12 3.81,-1.27; P$13 6.35,-1.27; P$14 8.89,-1.27; P$15 11.43,-1.27; P$16 13.97,-1.27; P$17 16.51,-1.27; P$18 19.05,-1.27; P$19 21.59,-1.27; P$20 24.13,-1.27 | smd 0.635 x 2.794 bottom: P$21 24.13,-1.27; P$22 21.59,-1.27; P$23 19.05,-1.27; P$24 16.51,-1.27; P$25 13.97,-1.27; P$26 11.43,-1.27; P$27 8.89,-1.27; P$28 6.35,-1.27; P$29 3.81,-1.27; P$30 1.27,-1.27; P$31 -1.27,-1.27; P$32 -3.81,-1.27; P$33 -6.35,-1.27; P$34 -8.89,-1.27; P$35 -11.43,-1.27; P$36 -13.97,-1.27; P$37 -16.51,-1.27; P$38 -19.05,-1.27; P$39 -21.59,-1.27; P$40 -24.13,-1.27
L3010 = smd 0.65 x 1.2: P$1 -1.375,0; P$2 1.375,0
CHIPLED_0603 = smd 0.8 x 0.8: A 0,-0.75; C 0,0.75
UX60A-MB-5ST = smd 2 x 0.5: 1 2.25,1.6; 2 2.25,0.8; 3 2.25,0; 4 2.25,-0.8; 5 2.25,-1.6 | smd 2.2 x 2.5: M1 -3.3,-4.2; M2 -3.3,4.2; M3 2,4.2; M4 2,-4.2
R0402 = smd 0.7 x 0.9: 1 -0.65,0; 2 0.65,0
BS3N = smd 8.4 x 1: 1 -0.01,-2.035; 2 0,2.035

### Placement (x,y rotation side)
C1  13.77,28.96 90 top
C2  16.12,32.52 270 top
C3  13.77,32.52 270 top
C4  15.91,28.97 90 top
C5  19.89,13.79 0 top
C6  11.02,3.71 270 top
C7  4.09,3.71 270 top
C8  6.73,17.93 0 top
C9  13.06,20.65 90 top
C10  12.52,11.81 0 top
C11  3.53,11.71 180 top
C12  55.49,45.3 90 top
C13  55.5,20.95 270 top
C14  58.58,47.02 45 top
C15  43.54,29.64 180 top
C16  45.49,26.04 0 top
C17  43.03,38.3 180 top
C18  69.56,25.38 0 top
C19  49.18,11.71 315 top
C20  28.22,29.69 270 top
C21  69.52,26.83 0 top
C22  37.19,7.11 0 top
C23  47.19,37.54 180 top
C24  68.48,21.08 180 top
C25  7.34,40.21 0 top
C26  18.54,45.16 0 top
C27  7.54,48.84 0 top
CLK  21.59,9.14 180 top
FB  11.48,29.06 90 top
IC1  35.88,17.14 180 top
IC2  7.49,11.07 270 top
IC3  20.09,20.85 90 top
IC4  59.5,33.59 270 top
IC5  30.89,39.85 180 top
JP1  23.06,46.99 0 top
JP2  51.28,47.73 180 top
JP3  78.74,25.4 270 top
JP4  59.49,6.5 0 top
JP4_1  69.67,3.94 180 top
JP36  85.09,25.4 270 top
L1  12.34,8.66 270 top
L2  13.06,17.14 90 top
L3  3.02,15.54 270 top
L4  2.59,7.72 270 top
LED1  45.11,4.95 0 top
LED2  46.63,4.95 0 top
LED3  48.16,4.95 0 top
LED4  49.68,4.95 0 top
LED5  51.21,4.95 0 top
LED6  52.73,4.95 0 top
LED7  54.25,4.93 0 top
LED8  55.78,4.93 0 top
MINI_B  6.43,25.4 0 top
R1  45.11,7.9 270 top
R2  46.63,7.9 270 top
R3  48.16,7.9 270 top
R4  49.68,7.9 270 top
R5  51.21,7.85 270 top
R6  52.73,7.9 270 top
R7  54.25,7.87 270 top
R8  55.78,7.82 270 top
R9  3.2,40.16 180 top
R10  14.38,45.16 180 top
R11  3.3,48.82 180 top
R12  15.47,3.07 0 top
R17  20.57,27.94 180 top
R18  9.73,6.3 0 top
R19  9.37,3.71 90 top
R20  6.38,6.32 180 top
R21  7.06,3.71 90 top
R22  6.73,15.85 180 top
R23  9.37,17.27 270 top
R24  12.4,14.12 0 top
R25  10.67,17.27 270 top
SW1  5.29,35.97 180 top
SW2  16.48,41.01 180 top
SW3  5.42,44.93 180 top

### Tracks (layer width: path | path; a pad name or v marks a point on that pad's centre or on a via)
1.8V  (via drill 0.3)
  Top 0.254: IC1.57 29.52,20.14 arc90 v29.54,20.17 | v29.54,30.33 28.23,30.33 C20.1 | IC1.26 41.88,25.55 42.37,26.04 v43.41,26.04 C16.1 | L3.P$1 v3.02,17.93 C8.1 R22.2
  Route2 0.813: 29.54,26.04 v29.54,20.17 28.75,19.38 4.47,19.38 v3.02,17.93 | v29.54,30.33 29.54,26.04 | 29.54,26.04 v43.41,26.04
  Route15 0.254: v29.54,20.17 v29.54,30.33
_D1
  Top 0.254: IC1.40 34.88,29.14 37.82,32.08 IC4.41
_D2
  Top 0.254: IC1.41 34.38,29.45 37.52,32.59 IC4.40
_D3  (via drill 0.3)
  Top 0.254: IC1.77 30.38,11.87 v30.39,11.89 | v36.09,34.9 36.4,34.59 IC4.36
  Route15 0.254: v30.39,11.89 30.95,12.45 34.8,12.45 39.7,17.35 39.7,23.06 36.8,25.96 36.8,29.01 35.76,30.05 35.76,34.57 v36.09,34.9
_D4  (via drill 0.3)
  Top 0.254: IC1.78 30.88,11.22 31.77,12.12 31.77,13.22 v31.79,13.23 | v36.3,36.22 37.42,35.09 IC4.35
  Route15 0.254: v31.79,13.23 32.58,14.02 35.38,14.02 39.09,17.73 39.09,22.76 35.15,26.7 35.15,35.08 v36.3,36.22
_D5  (via drill 0.3)
  Top 0.254: IC1.79 31.38,10.9 33.33,12.85 33.33,14.8 v33.31,14.81 | v37.21,37.36 38.98,35.59 IC4.34
  Route15 0.254: v33.31,14.81 33.8,15.29 35.81,15.29 38.53,18.01 38.53,22.4 34.59,26.34 34.59,36.85 35.97,38.23 36.35,38.23 v37.21,37.36
_D6  (via drill 0.3)
  Top 0.254: IC1.81 32.38,10.58 34.54,12.75 34.54,16.04 v34.56,16.05 | v38.02,37.87 39.8,36.09 IC4.33
  Route15 0.254: v34.56,16.05 35.61,16.05 37.95,18.39 37.95,22.05 34.09,25.91 34.09,37.44 35.74,39.09 36.8,39.09 v38.02,37.87
_D7  (via drill 0.3)
  Top 0.254: IC1.89 36.38,16.01 v35.45,16.94 | IC4.32 51.61,36.58 40.89,36.58 v38.73,38.73
  Route15 0.254: v35.45,16.94 35.45,17.18 37.29,19.02 37.29,21.79 33.48,25.6 33.48,38.15 35.2,39.88 37.59,39.88 v38.73,38.73
AGND  (via drill 0.3)
  Top 0.254: 13.18,10.82 IC2.14 7.49,10.82 IC2.P$17 7.24,11.32 IC2.6 5.21,11.32 4.83,11.71 C11.1 | 13.18,10.82 14.3,10.82 v14.33,10.85 | 2.81,3.06 C7.2 R21.1 R19.1 C6.2 14.82,3.06 R12.1 | C8.2 9.36,17.93 | R23.1 R25.1 v10.69,20.7 10.71,21.3 C9.2 | 13.13,12.06 C10.2 13.18,12.06 13.18,10.82
  Top 0.61: 2.81,3.06 v2.72,3.07 | 9.36,17.93 R23.1
  other vias: 7.49,11.07
  pour Bottom (isolate 0.254): 1.22,1.17 1.22,22.76 16.46,22.76 16.46,1.17
BUSY  (via drill 0.3)
  Top 0.254: IC1.91 37.38,17.55 v35.45,19.48 | v42.57,40.28 44.98,40.28 45.67,39.6 IC4.26
  Route15 0.254: v35.45,19.48 35.47,19.82 36.02,20.34 36.25,20.57 36.25,21.16 32.38,25.02 32.38,38.84 34.42,40.87 42.11,40.87 42.57,40.41 v42.57,40.28
CCLK  (via drill 0.3)
  Top 0.254: IC1.27 | IC1.27 41.38,26.31 42.09,27.03 47.52,27.03 48.09,27.59 IC4.50 51.63,27.58 52.58,27.58 52.93,27.94 52.93,28.14 53.85,29.06 v53.85,29.46 | 25.91,40.48 v25.88,40.51 25.88,40.49 IC5.6 | IC1.27 41.38,23.67 41.55,23.5 42.09,23.5 42.57,23.98 42.57,24.38 v42.98,24.79
  Route15 0.254: v25.88,40.51 25.88,42.55 27.05,43.71 52.7,43.71 54.59,41.83 54.59,38.33 56.29,36.65 56.29,34.87 54.76,33.35 54.74,30.71 53.85,29.82 v53.85,29.46
CE
  Top 0.254: 26.34,13.66 IC1.70
  Top 0.61: CLK.1 24.04,12.5 25.2,13.66 26.34,13.66
CPLD_11
  Top 0.203: JP4_1.4 60.78,5.33 60.78,6.91 52.07,15.62 46.02,15.62 45.5,16.14 IC1.11
CPLD_12
  Top 0.203: JP4.2 51.82,16.59 48.23,16.59 47.7,16.03 46.3,16.03 45.69,16.67 43.78,16.67 IC1.12
CPLD_13
  Top 0.203: JP4_1.3 63.37,5.03 63.37,6.99 62.53,7.82 61.39,7.82 52.17,17.04 47.85,17.04 47.27,16.46 46.61,16.46 45.92,17.14 IC1.13
CPLD_15
  Top 0.203: JP4.3 62.94,8.26 61.65,8.26 51.76,18.14 IC1.15
CPLD_16
  Top 0.203: JP4_1.2 65.81,5.38 65.81,7.16 64.21,8.76 61.8,8.76 51.92,18.64 IC1.16
CPLD_17
  Top 0.203: JP4.4 67.11,7.24 65.08,9.27 61.9,9.27 52.03,19.14 IC1.17
CPLD_18
  Top 0.203: JP4_1.1 68.4,5.08 68.4,7.11 65.63,9.88 62.05,9.88 52.29,19.64 IC1.18
CPLD_19
  Top 0.203: JP4.5 65.91,10.36 62.31,10.36 52.52,20.14 IC1.19
CSO_B  (via drill 0.3)
  Top 0.254: IC1.94 38.88,10.25 39.42,10.79 40.34,10.79 v40.62,11.07 | IC4.24 54,42.47 53.42,43.05 49.53,43.05 v48.9,42.42 48.87,42.44 38.91,42.44 36.73,40.26 36.73,38.89 35.79,37.95 IC5.1
  Route15 0.254: v40.62,11.07 40.62,15.72 48.92,24.03 v48.9,42.42
D0
  Top 0.254: IC3.1 27.99,16.63 IC1.64
D1
  Top 0.254: IC3.5 26.04,19.23 26.44,19.63 IC1.58
D2
  Top 0.254: IC3.3 25.95,17.93 26.67,18.64 IC1.60
D3
  Top 0.254: IC1.52 26.63,22.64 26.16,23.11 23.76,23.11 IC3.11
D4
  Top 0.254: IC3.2 26.07,17.28 26.92,18.14 IC1.61
D5
  Top 0.254: IC3.9 25.82,21.83 26.49,21.16 27.99,21.16 IC1.55
D6
  Top 0.254: IC1.53 26.42,22.14 26.09,22.48 IC3.10
D7
  Top 0.254: IC3.6 25.82,19.88 26.59,20.65 IC1.56
DGND  (via drill 0.3)
  Top 0.203: IC4.72 64,26.63 63.8,26.82 62.08,26.82 v61.44,27.46 | IC4.81 68.24,30.09 v68.3,30.1 | C21.2 70.21,26.79 C18.2 v70.21,23.32 | C14.2 59.94,48.39 v60.4,48.39
  Top 0.254: IC3.18 18.41,23.13 v18.41,22.94 | IC3.26 17.7,17.93 v17.96,18.26 17.64,18.58 IC3.25 | IC3.21 17.71,21.18 17.98,20.9 18.62,20.9 v19.13,20.4 | 17.96,13.79 v17.91,13.79 | IC3.7 v22.46,20.53 v22.45,20.52 | IC4.19 56.5,39.99 v56.49,38.86 | IC4.14 59,40.01 v59.03,39.98 | IC4.59 57.53,25.75 v57.53,28.17 | IC4.87 67.37,33.12 v64.01,33.12 | IC4.93 v65.56,36.09 | v53.16,33.83 52.88,34.09 IC4.37 | IC4.29 51.64,38.08 v53.14,38.08 | C19.2 49.64,11.17 v50.37,10.44 | v45.09,37.54 C23.2 | C17.2 v41.22,38.3 | IC1.100 v41.88,11.68 | IC4.52 v54,24.33 | C15.2 v41.68,29.64 | C13.2 55.52,19.16 v55.5,18.87 | IC1.84 33.88,10.28 v34.59,11 | IC4.7 62.5,39.66 v62.48,39.65 | IC1.62 v29.84,17.64 v29.84,17.65 | IC1.69 29.79,14.14 v29.84,14.2 | IC1.21 49.92,21.14 v50.44,21.67 | C12.2 55.49,47.58 v55.47,47.6 | IC1.31 39.38,27.03 v39.47,27.13 | SW1.2 5.29,35.74 v5.31,35.76 | SW3.2 5.42,44.8 v5.44,44.81 | SW2.2 16.48,40.89 v16.51,40.92 | C20.2 28.22,27.84 v28.25,27.81 | C16.2 v47.47,26.04 | C22.2 37.84,5.72 v37.85,5.71 | MINI_B.4 10.5,24.6 v10.9,24.21 10.49,23.8 MINI_B.5 | IC5.4 32.56,41.76 v32.56,41.27 | IC4.64 60,27.35 v59.18,28.17 | R12.2 18.09,3.07 v18.11,3.1
  Top 0.406: C24.- 70.21,21.08 v70.21,23.32
  Top 0.813: CLK.2 v20.9,11.05 | C5.1 17.96,13.79 | C26.2 v20.65,45.16 | C27.2 8.19,48.9 v9.4,48.9 | C25.2 7.99,42.89 SW3.2
  other vias: 14.91,30.81 29.62,41.25 30.89,39.9
  pour Bottom (isolate 0.279, rank 2): 1.22,1.17 1.22,50.09 85.22,50.09 85.22,1.17
  pour Top (no thermals): 13.34,32.08 16.61,32.08 16.61,29.46 13.34,29.46
DIN/_D0  (via drill 0.3)
  Top 0.254: IC1.35 37.38,28.56 39.42,30.61 51.61,30.61 IC4.44 51.63,30.58 52.68,30.58 53.98,31.88 v53.98,31.93 | IC5.2 35.61,39.22 36.2,39.8 36.2,41.15 v37.26,42.22
  Route15 0.254: v53.98,31.93 53.98,40.74 51.61,43.1 38.15,43.1 v37.26,42.22
DONE  (via drill 0.3)
  Top 0.254: IC1.28 40.88,23.13 41.15,22.86 42.09,22.86 43.16,23.93 46.66,23.93 v46.69,23.9 | v52.45,23.9 53.5,24.95 IC4.51
  Bottom 0.254: v46.69,23.9 v52.45,23.9
FPGA_2
  Top 0.203: JP3.33 78.59,33.05 75.84,33.05 66.5,42.39 65.41,42.39 65,41.99 IC4.2
  Bottom 0.203: JP3.33 JP36.P$33
FPGA_3
  Top 0.203: IC4.3 64.5,42.25 65.08,42.82 66.95,42.82 75.56,34.21 77.52,34.21 JP3.7 78.36,34.29 79.68,32.97 80.8,32.97 82.12,34.29 JP36.P$7
FPGA_4
  Top 0.203: JP3.34 79.02,35.41 75.51,35.41 67.64,43.28 64.8,43.28 64,42.49 IC4.4
  Bottom 0.203: JP3.34 JP36.P$34
FPGA_5
  Top 0.203: IC4.5 63.5,42.27 63.52,42.29 63.52,42.65 64.57,43.69 68,43.69 74.88,36.8 77.32,36.8 JP3.6 78.33,36.83 79.53,35.64 80.26,35.64 81.46,36.83 JP36.P$6
FPGA_9
  Top 0.203: JP3.35 78.56,38.15 74.37,38.15 68.38,44.15 63.25,44.15 61.49,42.39 IC4.9
  Bottom 0.203: JP3.35 JP36.P$35
FPGA_10
  Top 0.203: IC4.10 61,42.74 62.87,44.6 68.78,44.6 74.02,39.37 JP3.5 78.56,39.37 79.68,38.25 80.72,38.25 81.84,39.37 JP36.P$5
FPGA_11
  Top 0.203: JP3.36 78.97,40.54 73.84,40.54 69.32,45.06 62.56,45.06 60.5,43 IC4.11
  Bottom 0.203: JP3.36 JP36.P$36
FPGA_12
  Top 0.203: IC4.12 60,43.21 62.28,45.49 69.57,45.49 73.15,41.91 JP3.4 78.33,41.91 79.53,40.72 80.42,40.72 81.61,41.91 JP36.P$4
FPGA_13
  Top 0.203: JP3.37 78.69,43.1 72.69,43.1 69.93,45.87 62,45.87 59.5,43.37 IC4.13
  Bottom 0.203: JP3.37 JP36.P$37
FPGA_15
  Top 0.203: IC4.15 58.5,43.08 61.77,46.35 70.56,46.35 72.49,44.42 77.57,44.42 JP3.3 78.61,44.45 79.78,43.28 80.85,43.28 82.02,44.45 JP36.P$3
FPGA_16
  Top 0.203: JP3.38 79.07,45.52 72.29,45.52 70.97,46.84 61.52,46.84 58,43.32 IC4.16
  Bottom 0.203: JP3.38 JP36.P$38
FPGA_17
  Top 0.203: IC4.17 57.5,43.63 61.87,48.01 61.87,49.05 60.98,49.94 56.11,49.94 53.75,47.57 51.31,47.57 JP2.1
FPGA_18
  Top 0.203: IC4.18 57,43.87 61.34,48.21 61.34,48.74 60.86,49.23 56.16,49.23 54.36,47.42 54.36,46.2 53.47,45.31 49.68,45.31 48.74,46.25 JP2.2
FPGA_22
  Top 0.203: IC4.22 55,42.74 53.52,44.22 47.02,44.22 46.25,44.98 46.25,47.55 JP2.3
FPGA_23
  Top 0.203: IC4.23 54.5,42.6 53.44,43.66 44.91,43.66 43.69,44.88 43.69,47.83 JP2.4
FPGA_58  (via drill 0.3)
  Top 0.203: JP3.20 72.59,6.02 72.59,12.27 71.86,13.01 63.12,13.01 57,19.12 IC4.58 | v81.15,2.06 81.94,1.27 JP36.P$20
  Bottom 0.203: JP3.20 78.38,1.27 79.43,2.31 80.42,2.31 80.67,2.06 v81.15,2.06
FPGA_60
  Top 0.203: JP3.21 78.59,2.56 77.34,2.56 76.5,3.4 76.5,3.83 73.03,7.32 73.03,12.72 72.24,13.51 63.3,13.51 58,18.81 IC4.60
  Bottom 0.203: JP3.21 JP36.P$21
FPGA_61
  Top 0.203: IC4.61 58.5,19 63.42,14.07 72.39,14.07 73.46,13.01 73.46,7.95 JP3.19 78.61,3.81 79.68,2.74 80.7,2.74 81.74,3.79 83.8,3.79 JP36.P$19
FPGA_62
  Top 0.203: JP3.22 78.84,5.11 77.04,5.11 76.22,5.92 76.22,6.48 73.86,8.84 73.86,13.18 72.47,14.58 63.5,14.58 59,19.11 IC4.62
  Bottom 0.203: JP3.22 JP36.P$22
FPGA_63
  Top 0.203: IC4.63 59.5,19.21 63.55,15.16 72.49,15.16 74.32,13.34 74.32,9.37 JP3.18 78.38,6.35 79.5,5.23 80.37,5.23 81.48,6.35 JP36.P$18
FPGA_65
  Top 0.203: JP3.23 78.46,7.77 77.14,7.77 76.48,8.43 76.48,9.02 74.8,10.69 74.8,13.49 72.54,15.75 63.58,15.75 60.5,18.82 IC4.65
  Bottom 0.203: JP3.23 JP36.P$23
FPGA_66
  Top 0.203: IC4.66 61,18.96 63.63,16.33 72.57,16.33 75.26,13.64 75.26,11.23 JP3.17 78.59,8.89 79.7,7.77 80.49,7.77 81.61,8.89 JP36.P$17
FPGA_67
  Top 0.203: JP3.24 78.84,10.19 77.09,10.19 75.72,11.56 75.72,13.87 72.75,16.84 63.7,16.84 61.5,19.04 IC4.67
  Bottom 0.203: JP3.24 JP36.P$24
FPGA_68
  Top 0.203: IC4.68 62,19.2 63.93,17.27 72.95,17.27 76.12,14.1 76.12,12.65 JP3.16 78.36,11.43 79.48,10.31 80.44,10.31 81.56,11.43 JP36.P$16
FPGA_69
  Top 0.203: JP3.25 78.66,12.65 77.39,12.65 76.5,13.54 76.5,14.33 73.03,17.8 64.01,17.8 62.5,19.31 IC4.69
  Bottom 0.203: JP3.25 JP36.P$25
FPGA_70
  Top 0.203: IC4.70 63,19.45 64.06,18.39 73.18,18.39 JP3.15 78.56,13.97 79.65,12.88 80.67,12.88 81.74,13.95 83.8,13.95 JP36.P$15
FPGA_71
  Top 0.203: JP3.26 78.74,15.37 76.99,15.37 73.48,18.87 64.19,18.87 63.5,19.56 IC4.71
  Bottom 0.203: JP3.26 JP36.P$26
FPGA_78
  Top 0.203: IC4.78 70.06,28.59 70.06,28.62 73.38,25.3 73.38,20.47 JP3.14 78.33,16.51 79.45,15.39 80.31,15.39 81.43,16.51 JP36.P$14
FPGA_79
  Top 0.203: JP3.27 78.41,17.98 77.14,17.98 76.4,18.72 76.4,19.3 73.84,21.87 73.81,25.6 70.32,29.09 IC4.79
  Bottom 0.203: JP3.27 JP36.P$27
FPGA_84
  Top 0.203: IC4.84 67.42,31.55 68.45,31.55 74.3,25.7 74.27,22.38 JP3.13 78.54,19.05 79.63,17.96 80.64,17.96 81.71,19.02 83.8,19.02 JP36.P$13
FPGA_85
  Top 0.203: JP3.28 78.64,20.55 76.86,20.55 74.68,22.73 74.7,25.96 68.58,32.08 67.39,32.08 IC4.85
  Bottom 0.203: JP3.28 JP36.P$28
FPGA_86
  Top 0.203: IC4.86 68.71,32.59 75.13,26.16 75.13,23.8 JP3.12 78.38,21.59 79.48,20.5 80.31,20.5 81.36,21.54 83.77,21.54 JP36.P$12
FPGA_88
  Top 0.203: JP3.29 79.35,21.59 78.16,22.78 77.01,22.78 75.54,24.26 75.54,26.44 68.38,33.6 67.39,33.6 IC4.88
  Bottom 0.203: JP3.29 JP36.P$29
FPGA_89
  Top 0.203: IC4.89 68.55,34.09 75.92,26.72 75.92,25.76 76.53,25.15 JP3.11 78.56,24.13 79.63,23.06 80.82,23.06 81.86,24.11 83.8,24.11 JP36.P$11
FPGA_90
  Top 0.203: JP3.30 78.74,25.53 77.01,25.53 76.3,26.21 76.3,27 68.74,34.59 IC4.90
  Bottom 0.203: JP3.30 JP36.P$30
FPGA_91
  Top 0.203: IC4.91 68.92,35.09 JP3.10 78.31,26.67 79.43,25.55 80.59,25.55 81.71,26.67 JP36.P$10
FPGA_92
  Top 0.203: JP3.31 78.59,27.96 76.96,27.96 69.34,35.59 IC4.92
  Bottom 0.203: JP3.31 JP36.P$31
FPGA_94
  Top 0.203: IC4.94 69.1,36.59 76.48,29.21 JP3.9 78.54,29.21 79.76,27.99 80.67,27.99 81.89,29.21 JP36.P$9
FPGA_95
  Top 0.203: JP3.32 78.99,30.35 76.05,30.35 69.31,37.09 IC4.95
  Bottom 0.203: JP3.32 JP36.P$32
FPGA_98
  Top 0.203: IC4.98 68.67,38.59 75.51,31.75 JP3.8 78.33,31.75 79.63,30.45 80.57,30.45 81.86,31.75 JP36.P$8
FPGA_TDI  (via drill 0.3)
  Top 0.254: IC4.100 67.36,39.57 65.3,39.55 v63.65,37.9 | IC1.83 33.38,8.44 32.99,8.05 32.99,7.39 v33.12,7.26
  Route15 0.254: v33.12,7.26 38.25,7.26 39.4,8.41 40.92,8.41 43.2,10.69 43.2,16.48 58.06,31.34 58.06,32.31 v63.65,37.9
HOLD  (via drill 0.3)
  Top 0.254: IC1.76 29.88,8.52 v29.29,7.92 | v25.91,39.22 IC5.7
  Route15 0.254: v29.29,7.92 28.42,7.92 27.56,8.79 27.56,13.74 26.36,14.94 26.36,33.35 24.92,34.8 24.92,38.23 v25.91,39.22
HSWAP  (via drill 0.3)
  Top 0.203: IC4.99 68,39.09 68.15,39.24 68.15,39.95 68.05,40.06 64.64,40.06 64.58,39.99
  Top 0.254: IC1.24 46.95,22.64 v50.44,26.14 | 67.4,39.12 IC4.99 | v61.14,36.55 64.58,39.99
  Route15 0.254: v50.44,26.14 51.97,26.14 51.97,26.19 57.23,31.45 57.23,32.64 v61.14,36.55
INIT_B  (via drill 0.3)
  Top 0.254: IC1.92 37.88,18.32 v35.45,20.75 | 53.49,41.48 IC4.25 53.34,41.63 46.94,41.63 46.3,41 v43.61,41
  Route15 0.254: v35.45,20.75 31.62,24.57 31.62,39.06 34.09,41.53 42.88,41.53 43.41,41 v43.61,41
L2
  Top 0.203: JP3.2 78.38,46.99 79.48,45.9 80.29,45.9 81.38,46.99 JP36.P$2
L39
  Bottom 0.203: JP3.39 JP36.P$39
LED1
  Top 0.254: IC1.1 44.41,11.14 45.11,10.44 R1.1
LED2
  Top 0.254: IC1.2 44.9,11.64 46.63,9.91 R2.1
LED3
  Top 0.254: IC1.3 45.64,12.14 48.16,9.63 R3.1
LED4
  Top 0.254: IC1.4 46.64,12.64 49.68,9.6 R4.1
LED5
  Top 0.254: IC1.6 48.79,13.64 51.21,11.23 R5.1
LED6
  Top 0.254: IC1.7 49.56,14.14 52.73,10.97 R6.1
LED7
  Top 0.254: IC1.8 50.28,14.64 54.25,10.67 R7.1
LED8
  Top 0.254: IC1.9 51.07,15.14 55.78,10.44 R8.1
M0
  Top 0.254: IC1.36 36.88,28.93 39.04,31.09 IC4.43
M1
  Top 0.254: IC1.39 35.38,28.8 38.18,31.6 IC4.42
M2
  Top 0.254: IC1.42 33.88,29.89 37.08,33.1 IC4.39
MCLK
  Top 0.203: 62.94,31.09 63.52,31.67 66.04,31.67 66.6,31.09 IC4.83
  Top 0.254: IC1.22 | IC1.22 44.55,21.64 44.81,21.89 | IC4.83 | IC1.22 43.73,21.67 40.95,21.67
  Top 0.406: CLK.3 20.54,7.27 22.2,5.61 25.53,5.61 26.54,6.63 26.54,7.87 29.36,10.69 29.36,12.5 29.92,13.06 30.2,13.06 30.86,13.72 30.86,21.34 31.19,21.67 40.95,21.67 | 44.81,21.89 47.75,21.89 56.95,31.09 62.94,31.09
MOSI  (via drill 0.3)
  Top 0.254: IC1.90 36.88,16.78 v35.45,18.21 | IC4.27 45.16,39.09 44.73,39.52 v41.68,39.52 38.3,39.52 35.33,36.55 25.55,36.55 24.71,37.39 24.71,41.12 25.35,41.76 IC5.5
  Route15 0.254: v41.68,39.52 40.82,40.39 34.77,40.39 32.89,38.51 32.89,25.38 36.73,21.54 36.73,19.76 35.45,18.48 v35.45,18.21
N$2
  Top 0.254: IC2.1 8.24,13.07 9.37,14.2 R23.2 9.37,15.85 R22.1
N$3  (via drill 0.3)
  Top 0.254: IC2.2 7.74,13.76 v8.18,14.2 | v10.11,14.2 11.47,14.2 R24.1 11.46,14.41 | 10.67,16.23 11.76,15.14 11.76,14.14
  Top 0.61: 10.67,16.23 R25.2 | R24.1 11.76,14.14
  Route15 0.254: v8.18,14.2 v10.11,14.2
N$4
  Top 0.254: IC2.11 7.74,8.89 8.87,7.77 8.87,6.31 | 8.87,6.31 R18.1 | 8.87,6.31 8.87,5.31 9.37,4.8 R19.2
N$5
  Top 0.254: MINI_B.1 8.93,27.13 8.97,27.13 | FB.1 11.68,28.31 C1.1
  Top 0.61: FB.1 11.48,27.13 | 11.48,27.13 | 8.97,27.13 11.48,27.13
  Top 0.813: FB.1 11.46,28.09
N$6
  Top 0.254: IC2.10 7.24,7.65 7.04,7.44 7.04,6.33 R20.1 7.06,6.33 R21.2
N$7
  Top 0.254: IC2.13 10.3,10.32 10.59,10.03 L1.P$1
N$13
  Top 0.254: IC2.8 4.09,10.32 4.09,9.8 4.09,9.1 L4.P$1
N$16  (via drill 0.3)
  Top 0.254: v13.06,17.48 L2.P$2 | IC2.5 5.54,11.82 v5.54,12.62
  Route2 0.813: v5.54,12.62 8.18,12.62 9.75,11.05 10.36,11.05 11.02,11.71 arc90 11.4,12.09 11.4,16.69 12.19,17.48 v13.06,17.48
N$17
  Top 0.254: IC2.4 5.05,14.17 L3.P$2
N$183
  Top 0.254: IC3.17 17.81,23.78 18.44,24.41 18.44,26.47 16.59,28.32 C4.1
N$196
  Top 0.254: LED1.C R1.2
N$197
  Top 0.254: LED2.C R2.2
N$198
  Top 0.254: LED3.C R3.2
N$199
  Top 0.254: LED4.C R4.2
N$200
  Top 0.254: LED5.C R5.2
N$201
  Top 0.254: LED6.C R6.2
N$202
  Top 0.254: LED7.C R7.2
N$203
  Top 0.254: LED8.C R8.2
PROG_B  (via drill 0.3)
  Top 0.254: IC1.99 41.38,8.28 41.91,7.75 42.85,7.75 v43.33,8.23 | IC4.1 65.71,41.68 66.42,41.68 66.65,41.45 v66.65,41.12
  Route15 0.254: v43.33,8.23 53.82,18.72 53.82,22.35 58.37,26.92 58.37,30.02 66.65,38.28 v66.65,41.12
PWREN
  Top 0.254: 22.25,23.8 22.25,23.78 IC3.12 26.45,23.78 27.61,24.94 28.25,24.94 30.05,23.14 32.56,23.14 33.38,23.95 IC1.43
  Top 0.813: R17.1 21.22,23.8 22.25,23.8
RD
  Top 0.254: IC3.13 26.13,24.43 27.43,25.73 29.17,25.73 IC1.50
RDWR_B  (via drill 0.3)
  Top 0.254: IC4.38 37.71,33.59 v37.44,33.86 | v40.66,20.04 40.66,17.07 42.09,15.65 IC1.10
  Route15 0.254: v37.44,33.86 36.75,33.86 36.32,33.43 36.32,30.48 37.49,29.31 37.49,26.34 40.34,23.5 40.34,20.37 v40.66,20.04
RST  (via drill 0.3)
  Top 0.254: v17.86,5.13 17.2,5.79 17.2,14.71 16.79,15.11 16.2,15.11 15.11,16.2 15.11,22.28 15.32,22.48 IC3.19 | IC1.14 43.73,17.63 46.51,17.63 v46.94,17.2
  Route15 0.254: v46.94,17.2 46.94,13.11 41.58,7.75 40.13,7.75 38.96,6.58 29.06,6.58 27.61,5.13 v17.86,5.13
RX
  Top 0.254: IC3.23 17.46,19.88 22.68,14.66 27.99,14.66 IC1.68
SW1  (via drill 0.3)
  Top 0.254: SW1.1 9.19,38 v11.51,35.69 | v25.86,10.74 26.52,10.74 27.41,11.63 IC1.74
  Top 0.813: SW1.1 5.3,40.21 | 5.3,40.21 C25.1 | R9.1 3.85,40.21 5.3,40.21
  Route15 0.254: v11.51,35.69 12.6,34.59 21.29,34.59 24.11,31.77 24.11,12.5 v25.86,10.74
SW2  (via drill 0.3)
  Top 0.254: SW2.1 11.98,43.05 11.43,42.49 11.43,38.51 v12.6,37.34 | IC1.72 27.33,12.64 26.64,11.96 v26.59,11.96
  Top 0.813: SW2.1 16.49,45.16 | 16.49,45.16 C26.1 | 15.03,45.09 R10.1 16.49,45.16
  Route15 0.254: v12.6,37.34 12.6,36.37 13.61,35.36 21.57,35.36 24.69,32.23 24.69,12.72 25.5,11.91 26.54,11.91 v26.59,11.96
SW3  (via drill 0.3)
  Top 0.254: SW3.1 9.94,46.96 10.41,46.48 10.41,38.1 12.29,36.22 14.1,36.22 v14.12,36.25 | v25.78,12.8 26.59,12.8 26.95,13.16 27.99,13.16 IC1.71
  Top 0.813: SW3.1 5.43,48.84 | 5.43,48.84 C27.1 | R11.1 3.95,48.84 5.43,48.84
  Route15 0.254: v14.12,36.25 21.72,36.25 25.2,32.77 25.2,13.39 v25.78,12.8
TCK  (via drill 0.3)
  Top 0.203: IC4.77 66.68,28.09 66.12,28.65 66.12,28.96 v65.68,29.39
  Top 0.254: IC1.48 30.88,30.39 29.74,31.52 25.98,31.52 22.81,34.7 22.81,44.25 24.28,45.72 24.28,47.73 25.02,48.46 27.66,48.46 28.14,47.98 JP1.3
  Route15 0.254: JP1.3 28.14,47.55 28.93,48.34 36.75,48.34 39.85,45.24 64.9,45.24 68.12,42.01 68.12,36.47 66.55,34.9 66.55,30.68 65.68,29.82 v65.68,29.39
TDI
  Top 0.254: IC1.45 32.38,31.27 30.66,32.99 26.59,32.99 24.03,35.56 24.03,42.39 26.49,44.86 32.56,44.86 33.22,45.52 JP1.5
TDO  (via drill 0.3)
  Top 0.203: IC4.76 66.57,27.59 65.41,28.75 64.67,28.75 v64.44,28.98
  Top 0.254: IC4.76
  Route15 0.254: JP1.4 32.82,44.6 64.64,44.6 67.46,41.78 67.46,36.85 65.38,34.77 65.38,30.53 64.44,29.59 v64.44,28.98
TMS  (via drill 0.3)
  Top 0.254: IC1.47 31.38,30.95 30.18,32.16 26.42,32.16 23.44,35.13 23.44,42.82 26.14,45.52 28.7,45.52 29.44,46.25 29.44,48.28 30.23,49.07 34.95,49.07 35.74,48.28 35.74,46.76 JP1.6 v40.82,46.74 | IC4.75 65.5,24.7 v66.06,24.13
  Route15 0.254: v66.06,24.13 68.83,24.13 71.07,26.36 71.07,43.94 68.28,46.74 57.1,46.74 56.44,46.08 41.48,46.08 v40.82,46.74
TX
  Top 0.254: IC3.22 17.65,20.53 23.01,15.16 27.98,15.16 IC1.67
USBDM
  Top 0.254: IC3.16 17.37,24.43 17.73,24.79 17.73,25.58 17.13,26.18 8.83,26.18 MINI_B.2
USBDP
  Top 0.254: IC3.15 16.43,25.07 15.49,25.07 15.19,25.38 8.83,25.38 MINI_B.3
VCC  (via drill 0.3)
  Top 0.254: IC2.3 7.24,13.64 v6.66,14.22 | v9.07,8.91 9.07,9.67 IC2.12 | v2.67,13.13 2.67,11.71 C11.2 2.88,10.82 IC2.7 | IC2.9 5.82,9.67 v5.82,8.91 | C2.1 C3.1 11.35,33.17 11.35,32.18 | IC2.16 9.93,11.82 | 9.93,11.82 v9.93,12.85 | 9.93,11.82 11.86,11.82 C10.1 11.87,11.32 IC2.15
  Top 0.813: v1.52,32.18 11.35,32.18 11.46,32.18 11.48,32.16 FB.2
  Route2 0.813: v6.66,14.22 3.73,14.22 1.55,16.48 v1.52,32.18
  Route15 0.61: v9.07,8.91 v5.82,8.91 2.67,8.91 v2.67,13.13
  pour Route2: 1.32,19.15 10.21,19.15 10.21,11.25 1.27,11.25 1.27,19.18
VCCAUX  (via drill 0.3)
  Top 0.203: IC4.74 65,26.67 64.41,27.25 62.69,27.25 60.45,29.49 v60.45,29.72
  Top 0.254: C19.1 47.74,13.14 IC1.5 41.95,13.14 v41.94,13.13 | C15.1 44.62,29.21 46.3,29.21 46.69,29.59 IC4.46 52.68,29.59 53.65,30.56 54.46,30.56 v55.5,31.6 | 55.5,44.44 | 55.5,44.44 v55.5,43.36 55.5,42.72 IC4.21 55.5,40.39 54.63,39.52 54.63,36.17 v54.99,35.81 | 55.5,44.44 C12.1 | IC4.96 66.42,37.59 65.89,37.06 65.41,37.06 64.39,36.04 64.39,34.95 63.83,34.39 63.83,34.31 v62.92,33.4 | R24.2 15.47,14.12 v15.47,12.52 | 13.06,14.13 L2.P$1 | C9.1 13.96,19.98 14.45,19.48 14.45,16.15 14.07,15.77 L2.P$1
  Top 0.61: R24.2 13.06,14.13 | L2.P$1
  Route2 0.813: v15.47,12.52 22.38,12.52 25.7,9.2 36.25,9.2 40.21,13.16 41.91,13.16 | 41.91,13.16 41.91,15.72 50.62,24.43 | 50.62,24.43 55.93,29.74 | 41.91,13.16 v41.94,13.13 | 50.62,24.43 47.7,27.38 47.7,29.62 46.43,30.89 38.25,30.89 35.15,33.98 25.93,33.98 23.06,36.85 JP1.1
  pour Route2: 54.94,35.86 62.94,35.89 62.94,29.51 54.94,29.51
VCCINT  (via drill 0.3)
  Top 0.203: IC4.80 66.47,29.59 66.02,30.05 65.3,30.05 65.18,30.18 v63.93,30.18 63.32,29.57 63.32,29.01 64.03,28.3 65.23,28.3 66.67,26.85 68.86,26.85 C21.1
  Top 0.254: 10.59,6.29 R18.2 10.58,6.33 12.8,6.33 | 12.8,6.02 12.8,4.36 C6.1 | 12.8,6.02 12.8,6.25 | 12.8,6.25 12.8,6.33 | IC4.28 50.88,38.59 v50.42,38.12 48.92,38.12 48.74,38.3 C17.1 | IC4.6 63,42.38 v62.84,42.6 | 12.8,6.25 12.78,6.28 | 12.8,6.02 12.78,6.05 | v14.07,8 14.07,7.29 L1.P$2 12.8,7.29 12.8,6.33 | IC4.56 56,28.11 v56.49,28.6
  Route2 0.406: v56.49,28.6 57.1,29.21 59.51,29.21 60.05,28.68 61.32,28.68 62.81,30.18 v63.93,30.18 66.73,32.97 72.44,32.97
  Route2 0.813: v50.42,38.12 50.42,43.61 50.44,43.64
  pour Route2: 13.64,9.35 13.61,1.17 85.22,1.17 85.22,50.06 48.13,50.06 48.13,42.88 71.83,42.93 71.83,2.84 42.98,2.87 42.98,4.93 20.8,4.98 20.75,9.37 13.72,9.37
VCCO  (via drill 0.3)
  Top 0.203: IC4.82 65.09,30.59 64.87,30.81 63.48,30.81 62.69,30.02 62.69,28.5 v63.14,28.04 63.32,27.86 64.95,27.86 67.43,25.38 C18.1 | IC4.97 65.49,38.09 v65.33,38.25 | IC4.73 64.5,24.83 v64.49,24.43 | C14.1 56.44,44.89 56.44,42.9 56,42.46 IC4.20 56,39.82 55.4,39.22 55.4,38.25 56.19,37.47 v57.1,37.47 | JP3.1 78.54,49.53 79.6,48.46 80.57,48.46 81.64,49.53 JP36.P$1
  Top 0.254: IC3.4 23.75,18.59 21.61,18.59 21.39,18.82 | R20.2 v4.09,6.33 C7.1 | 35.87,9.26 IC1.88 35.88,8.19 v35.87,8.18 35.87,7.78 C22.1 | IC1.98 v40.88,6.51 v40.87,6.5 | IC4.31 50.06,37.09 v49.81,37.31 49.58,37.54 C23.1 | IC4.45 45.99,30.09 v45.7,29.87 | C13.1 v55.5,23.01 55.5,23.57 IC4.55 | IC1.51 28,23.97 v27.96,24 | IC1.38 35.88,27.95 v36.12,28.19 | v18.34,21.82 v18.33,21.83 IC3.20 | LED8.A LED7.A 54.23,4.2 LED6.A LED5.A LED4.A LED3.A LED2.A LED1.A 44.13,4.2 v44.12,4.22 | 4.07,6.35 L4.P$2 | IC5.8 25.93,37.95 v25.93,37.29 25.98,37.29 | IC4.8 62,40.49 v61.01,39.5 61.01,39.47
  Top 0.406: C24.+ 64.49,21.08 v64.49,24.43
  Top 0.61: v4.09,6.33 4.07,6.35
  Top 0.813: 21.39,18.82 21.39,21.82 19.51,21.82 | R17.2 19.93,21.81 19.51,21.82 | v1.4,40.16 R9.2 | v1.4,48.82 R11.2 | v12.29,45.16 R10.2 | v18.34,21.82 19.51,21.82 | C5.2 v22,13.79 22.15,13.64 22.15,7.34 22.16,7.36 CLK.4
  Route2 0.813: JP3.1 77.44,49.68 46.89,49.68
  pour Route2 (isolate 0.305, rank 3): 1.22,1.17 79.88,1.17 79.73,50.06 1.07,50.06
VS0
  Top 0.254: IC4.49 47.65,28.09 47.19,27.64 41.1,27.64 39.88,26.42 IC1.30
VS1
  Top 0.254: IC4.48 47.31,28.59 46.91,28.19 39.42,28.19 38.38,27.15 IC1.33
VS2
  Top 0.254: IC4.47 46.95,29.09 46.56,28.7 38.96,28.7 37.87,27.61 IC1.34
WR
  Top 0.254: IC3.14 25.36,25.08 26.75,26.47 29.57,26.47 30.38,25.65 IC1.49

### Text on the board
tPlace: 23 | 22 | 18 | 17 | VCCO | NC | FPGA_15 | FPGA_12 | FPGA_10 | FPGA_5 | FPGA_3 | FPGA_98 | FPGA_94 | FPGA_91 | FPGA_89 | FPGA_86 | FPGA_84 | FPGA_78 | FPGA_70 | FPGA_68 | FPGA_66 | VCCO | 12 | 15 | 17 | 19 | FPGA_63 | FPGA_61 | DGND | 11 | 13 | 16 | 18 | FPGA_58 | FPGA_58 | FPGA_60
bPlace: DGND | FPGA_16 | FPGA_13 | FPGA_11 | FPGA_9 | FPGA_4 | FPGA_2 | FPGA_95 | FPGA_92 | FPGA_90 | FPGA_88 | FPGA_85 | FPGA_79 | FPGA_71 | FPGA_69 | FPGA_67 | FPGA_65 | FPGA_62 | FPGA_60
tNames: VREF | GND | TCK | TDO | TDI | TMS
bNames: www.tapr.org/OHL | www.elec-real.com